# EAGLE design Uni-2.4 (EAGLE 9.6.2)

## Sheet 1 of 4
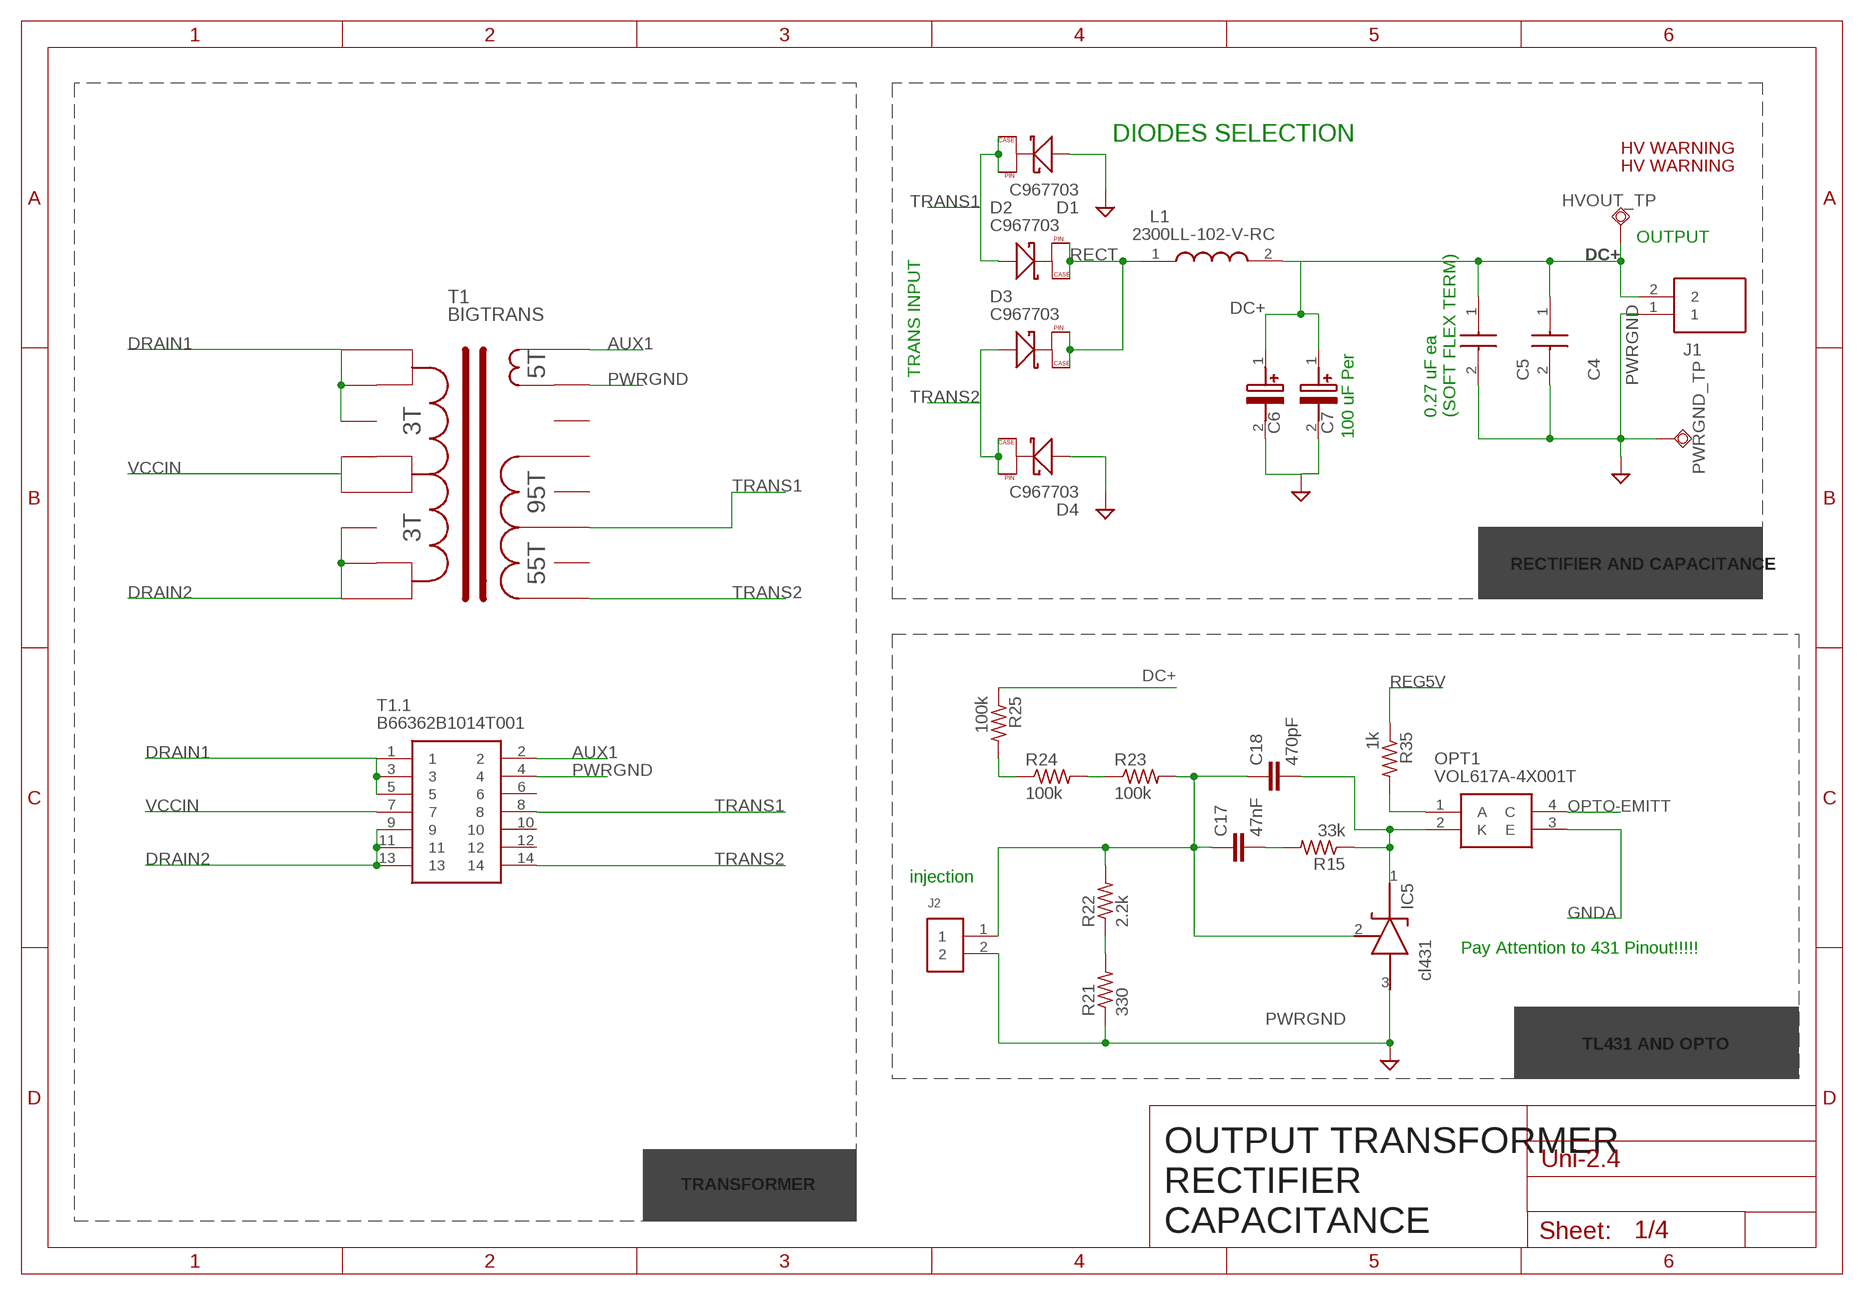
[diagram p0: schematic, sheet 1]

### Parts
C4  C1812C274KCRACAUTO  [C1812]
C5  C1812C274KCRACAUTO  [C1812]
C6  400BXW100MEFR18X25  [CAPPRD750W80D1825H2700]
C7  400BXW100MEFR18X25  [CAPPRD750W80D1825H2700]
C17  47nF  C-EUC0603K  [C0603K]
C18  470pF  C-EUC0603K  [C0603K]
D1  C967703  SICDIODE  [TO-252]
D2  C967703  SICDIODE  [TO-252]
D3  C967703  SICDIODE  [TO-252]
D4  C967703  SICDIODE  [TO-252]
HVOUT_TP  TPSQPAD1-13  [P1-13]
IC5  cl431  TL431CL3T  [SOT95P280X145-3N]
J1  TB005-762-02BE  [TB00576202BE]
J2  61300211121  [61300211121]
L1  2300LL-102-V-RC  [2300LL102VRC]
OPT1  VOL617A-4X001T  [SOP254P1015X230-4N]
PWRGND_TP  TPSQPAD1-13  [P1-13]
R15  33k  R-US_R0603  [R0603]
R21  330  R-US_R0805  [R0805]
R22  2.2k  R-US_R0805  [R0805]
R23  100k  R-US_R1206  [R1206]
R24  100k  R-US_R1206  [R1206]
R25  100k  R-US_R1206  [R1206]
R35  1k  R-US_R0603  [R0603]
T1  BIGTRANS  [BIGTRANS!]
T1.1  B66362B1014T001  [B66362B1014T001]
U$3  HV  [PSFBC_ELECTRIC_SHOCK]
U$4  HV  [PSFBC_ELECTRIC_SHOCK]

### Nets
AUX1: T1.1.2 T1.16 ; also sheet 3
DC+: C4.1 C5.1 C6.1(+) C7.1(+) HVOUT_TP.TP J1.2 L1.2 R25.1 ; also sheet 2
DRAIN1: T1.1.1 T1.1.3 T1.1.5 T1.6 T1.7 T1.8 ; also sheet 4
DRAIN2: T1.1 T1.1.9 T1.1.11 T1.1.13 T1.2 T1.3 ; also sheet 4
GNDA: OPT1.3(E) ; also sheet 3,4
N$1: R24.1 R25.2
N$3: C17.1 C18.1 IC5.2(REF) J2.1 R22.2 R23.2
N$15: R23.1 R24.2
N$16: R21.2 R22.1
N$18: C18.2 IC5.1(CATHODE) OPT1.2(K) R15.1
N$19: OPT1.1(A) R35.2
N$21: C17.2 R15.2
OPTO-EMITT: OPT1.4(C) ; also sheet 4
PWRGND: C4.2 C5.2 C6.2(-) C7.2(-) D1.2(A) D4.2(A) IC5.3(ANODE) J1.1 J2.2 PWRGND_TP.TP R21.1 T1.1.4 T1.15 ; supply symbol labelled GND ; also sheet 2,3
RECT: D2.1(K_1) D2.3(K_2) D3.1(K_1) D3.3(K_2) L1.1
REG5V: R35.1 ; also sheet 3
TRANS1: D1.1(K_1) D1.3(K_2) D2.2(A) T1.1.8 T1.11
TRANS2: D3.2(A) D4.1(K_1) D4.3(K_2) T1.1.14 T1.9
VCCIN: T1.1.7 T1.4 T1.5 ; also sheet 3,4
Unconnected: T1.1.6 T1.1.10 T1.1.12 T1.10 T1.12 T1.13 T1.14

### Notes on the sheet
- DIODES SELECTION
- OUTPUT
- TRANS INPUT
- 0.27 uF ea
  (SOFT FLEX TERM)
- 100 uF Per
- RECTIFIER AND CAPACITANCE
- injection
- Pay Attention to 431 Pinout!!!!!
- TL431 AND OPTO
- TRANSFORMER
- OUTPUT TRANSFORMER
  RECTIFIER
  CAPACITANCE

## Sheet 2 of 4
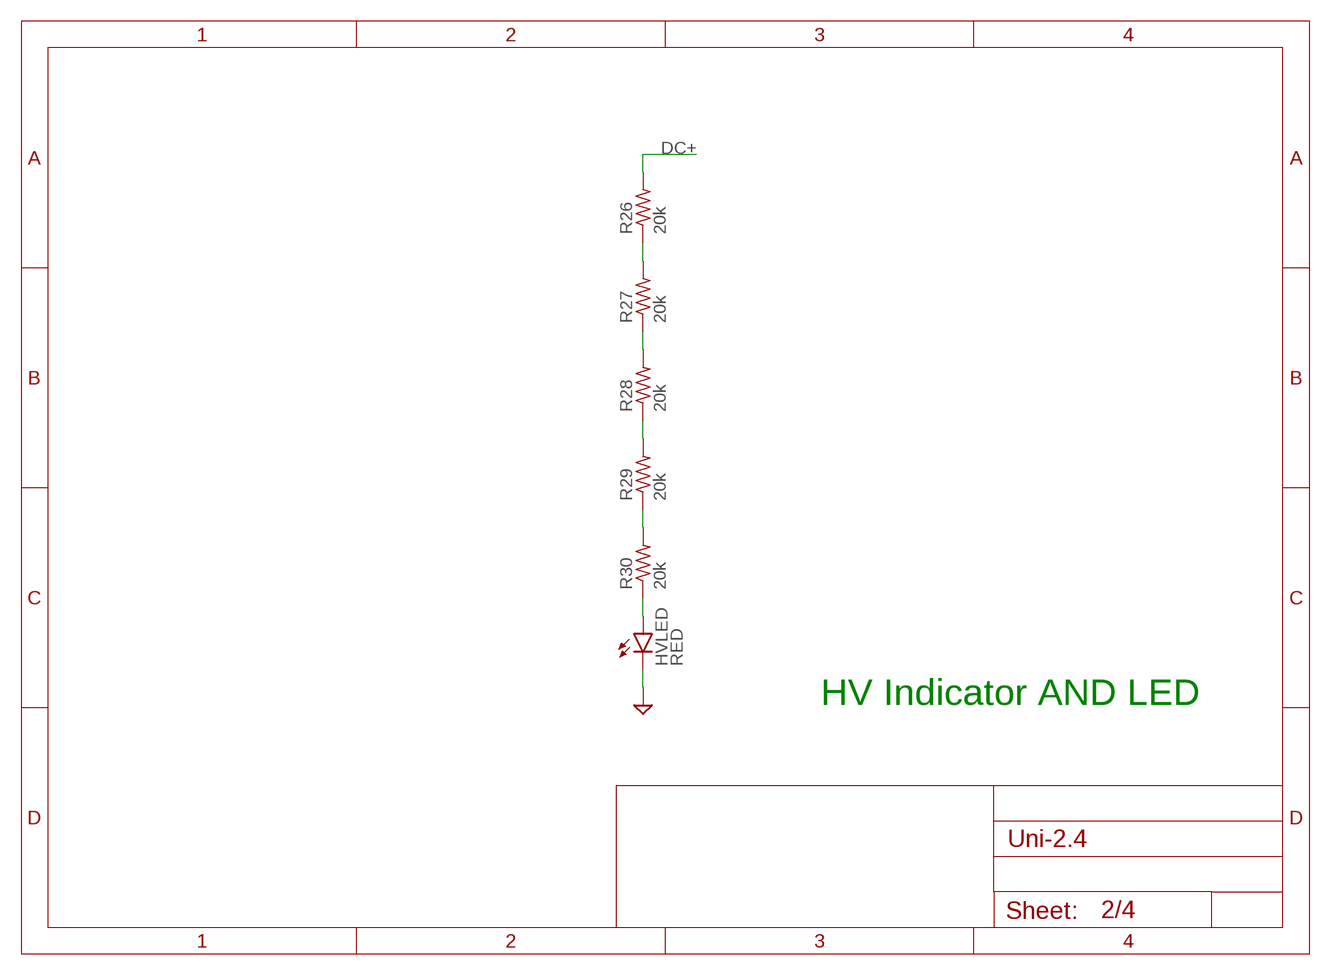
[diagram p1: schematic, sheet 2]

### Parts
HVLED  RED  LEDCHIPLED_0805  [CHIPLED_0805]
R26  20k  R-US_R1206  [R1206]
R27  20k  R-US_R1206  [R1206]
R28  20k  R-US_R1206  [R1206]
R29  20k  R-US_R1206  [R1206]
R30  20k  R-US_R1206  [R1206]

### Nets
DC+: R26.2 ; also sheet 1
N$12: HVLED.A R30.1
N$14: R29.1 R30.2
N$17: R28.1 R29.2
N$24: R27.1 R28.2
N$28: R26.1 R27.2
PWRGND: HVLED.C ; supply symbol labelled GND ; also sheet 1,3

### Notes on the sheet
- HV Indicator AND LED

## Sheet 3 of 4
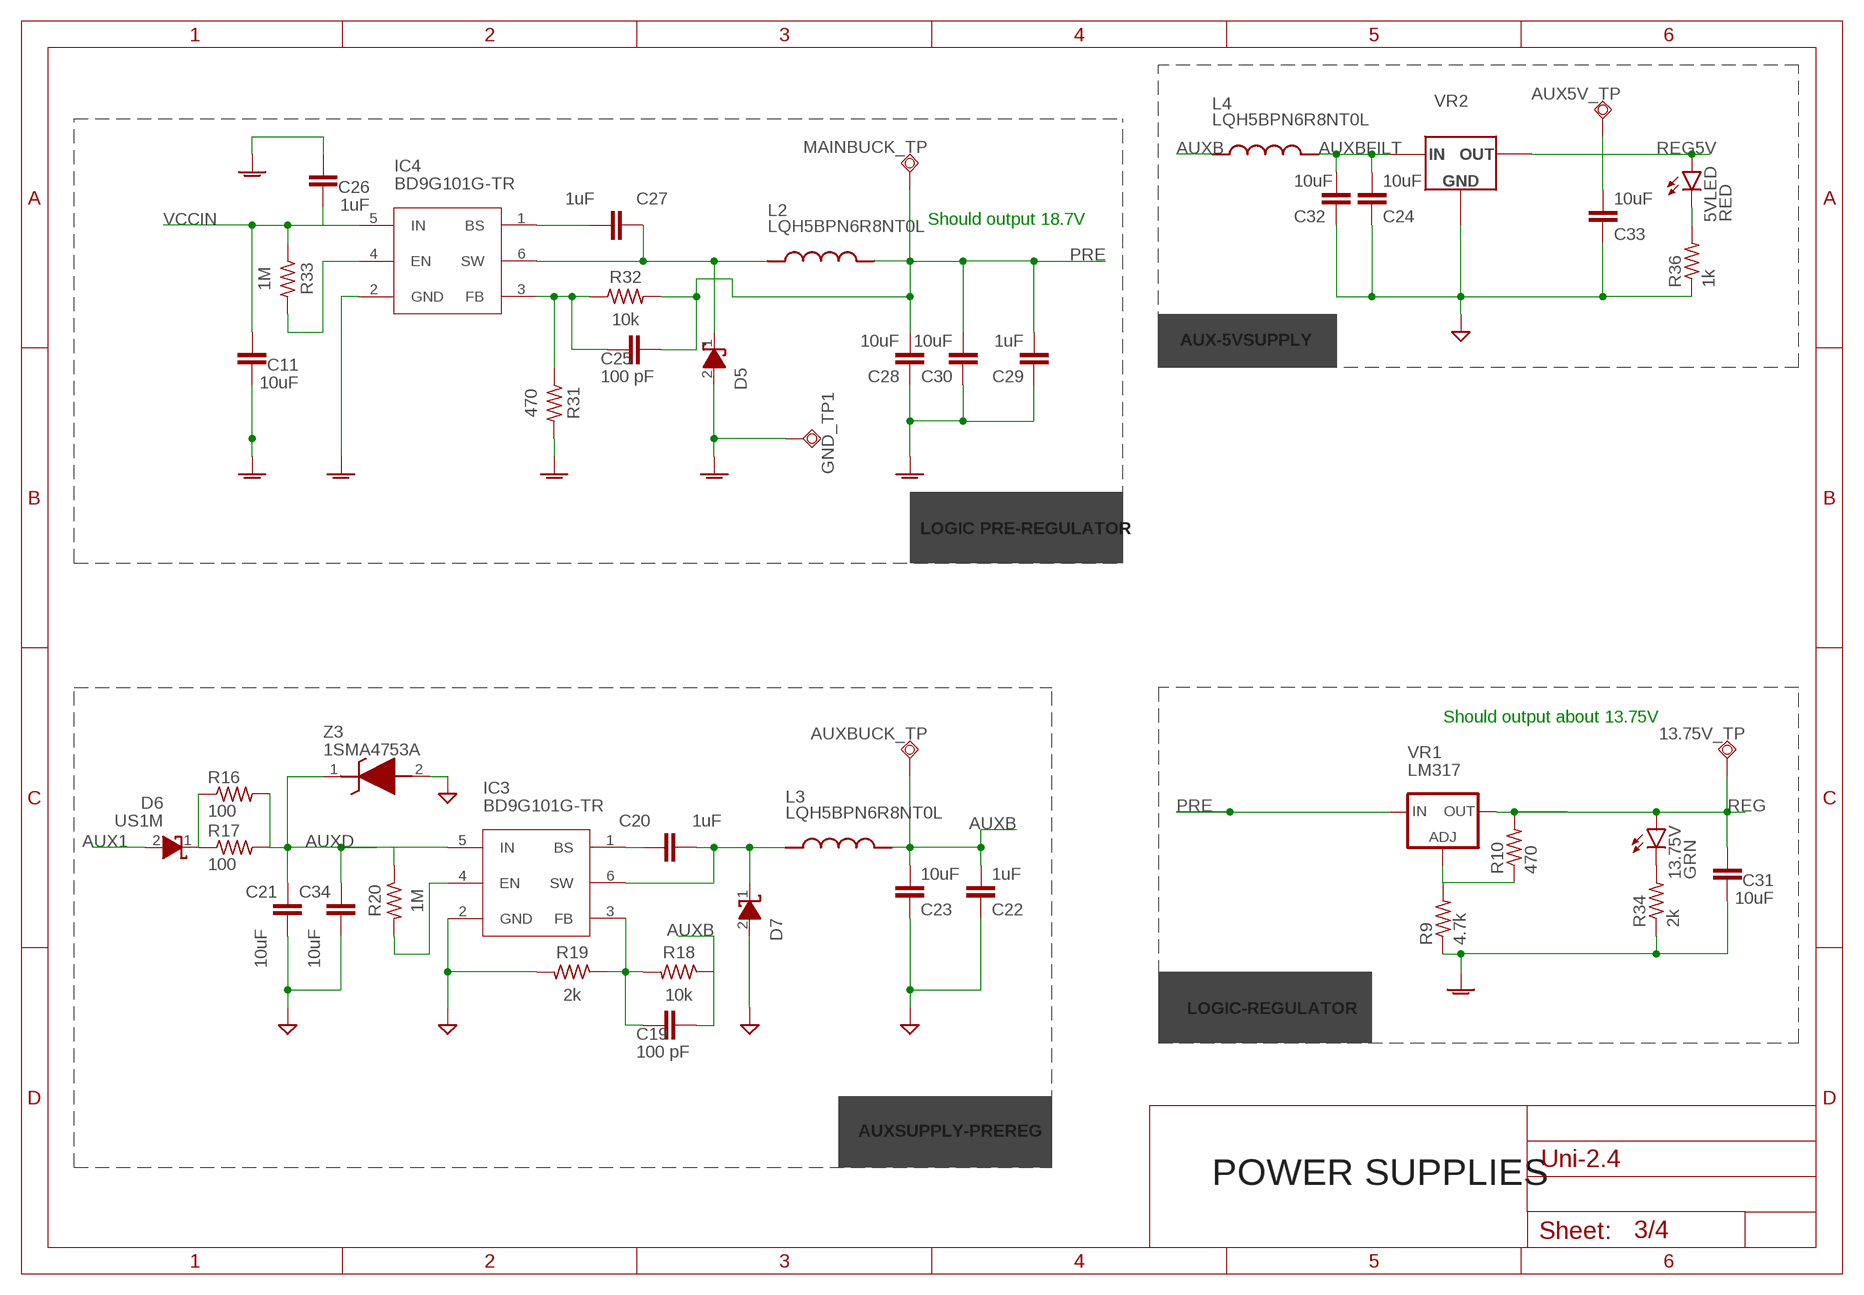
[diagram p2: schematic, sheet 3]

### Parts
5VLED  RED  LEDCHIPLED_0805  [CHIPLED_0805]
13.75V  GRN  LEDCHIPLED_0805  [CHIPLED_0805]
13.75V_TP  TPSQPAD1-17  [P1-17]
AUX5V_TP  TPSQPAD1-17  [P1-17]
AUXBUCK_TP  TPSQPAD1-17  [P1-17]
C11  10uF  C-EUC0805K  [C0805K]
C19  100 pF  C-EUC0402K  [C0402K]
C20  1uF  C-EUC0603K  [C0603K]
C21  10uF  C-EUC0805K  [C0805K]
C22  1uF  C-EUC0402  [C0402]
C23  10uF  C-EUC0603K  [C0603K]
C24  10uF  C-EUC0603K  [C0603K]
C25  100 pF  C-EUC0402K  [C0402K]
C26  1uF  C-EUC0603K  [C0603K]
C27  1uF  C-EUC0603K  [C0603K]
C28  10uF  C-EUC0603K  [C0603K]
C29  1uF  C-EUC0603K  [C0603K]
C30  10uF  C-EUC0603K  [C0603K]
C31  10uF  C-EUC0603K  [C0603K]
C32  10uF  C-EUC0603K  [C0603K]
C33  10uF  C-EUC0603K  [C0603K]
C34  10uF  C-EUC0805K  [C0805K]
D5  SCHOTTKY  [DIOM5127X229N]
D6  US1M  SCHOTTKY  [DIOM5127X229N]
D7  SCHOTTKY  [DIOM5127X229N]
GND_TP1  TPSQPAD1-13  [P1-13]
IC3  BD9G101G-TR  [SOT95P280X145-6N]
IC4  BD9G101G-TR  [SOT95P280X145-6N]
L2  LQH5BPN6R8NT0L  [LQH5BPB100MT0L]
L3  LQH5BPN6R8NT0L  [LQH5BPB100MT0L]
L4  LQH5BPN6R8NT0L  [LQH5BPB100MT0L]
MAINBUCK_TP  TPSQPAD1-17  [P1-17]
R9  4.7k  R-US_R0603  [R0603]
R10  470  R-US_R0603  [R0603]
R16  100  R-US_R1206  [R1206]
R17  100  R-US_R1206  [R1206]
R18  10k  R-US_R0402  [R0402]
R19  2k  R-US_R0402  [R0402]
R20  1M  R-US_R0402  [R0402]
R31  470  R-US_R0603  [R0603]
R32  10k  R-US_R0402  [R0402]
R33  1M  R-US_R0402  [R0402]
R34  2k  R-US_R0603  [R0603]
R36  1k  R-US_R0603  [R0603]
VR1  LM317  LM317MBDT  [DPACK]
VR2  AP2120N-5.0TRG1  [SOT95P280X145-3N]
Z3  1SMA4753A  1SMA5942BT3G  [DIOM5226X220N]

### Nets
AUX1: D6.2(A) ; also sheet 1
AUXB: AUXBUCK_TP.TP C19.1 C22.2 C23.2 L3.2 L4.1 R18.1
AUXBFILT: C24.2 C32.2 L4.2 VR2.3(VIN)
AUXD: C21.1 C34.1 IC3.5(IN) R16.2 R17.2 R20.1 Z3.1(K)
BS1: C27.2 IC4.1(BS)
BS2: C20.1 IC3.1(BS)
EN1: IC4.4(EN) R33.2
EN2: IC3.4(EN) R20.2
FB1: C25.2 IC4.3(FB) R31.1 R32.1
FB2: C19.2 IC3.3(FB) R18.2 R19.1
GNDA: C11.1 C26.2 C28.1 C29.1 C30.1 C31.1 D5.2(A) GND_TP1.TP IC4.2(GND) R9.1 R31.2 R34.1 ; also sheet 1,4
N$10: R9.2 R10.1 VR1.1(ADJ)
N$22: 13.75V.C R34.2
N$26: 5VLED.C R36.2
N$27: D6.1(K) R16.1 R17.1
PRE: C25.1 C28.2 C29.2 C30.2 L2.2 MAINBUCK_TP.TP R32.2 VR1.3(IN)
PWRGND: C21.2 C22.1 C23.1 C24.1 C32.1 C33.1 C34.2 D7.2(A) IC3.2(GND) R19.2 R36.1 VR2.1(GND) Z3.2(A) ; supply symbol labelled GND ; also sheet 1,2
REG: 13.75V.A 13.75V_TP.TP C31.2 R10.2 VR1.4(OUT) ; also sheet 4
REG5V: 5VLED.A AUX5V_TP.TP C33.2 VR2.2(VOUT) ; also sheet 1
SWITCH1: C27.1 D5.1(K) IC4.6(SW) L2.1
SWITCH2: C20.2 D7.1(K) IC3.6(SW) L3.1
VCCIN: C11.2 C26.1 IC4.5(IN) R33.1 ; also sheet 1,4

### Notes on the sheet
- Should output 18.7V
- AUX-5VSUPPLY
- LOGIC PRE-REGULATOR
- Should output about 13.75V
- LOGIC-REGULATOR
- AUXSUPPLY-PREREG
- POWER SUPPLIES

## Sheet 4 of 4
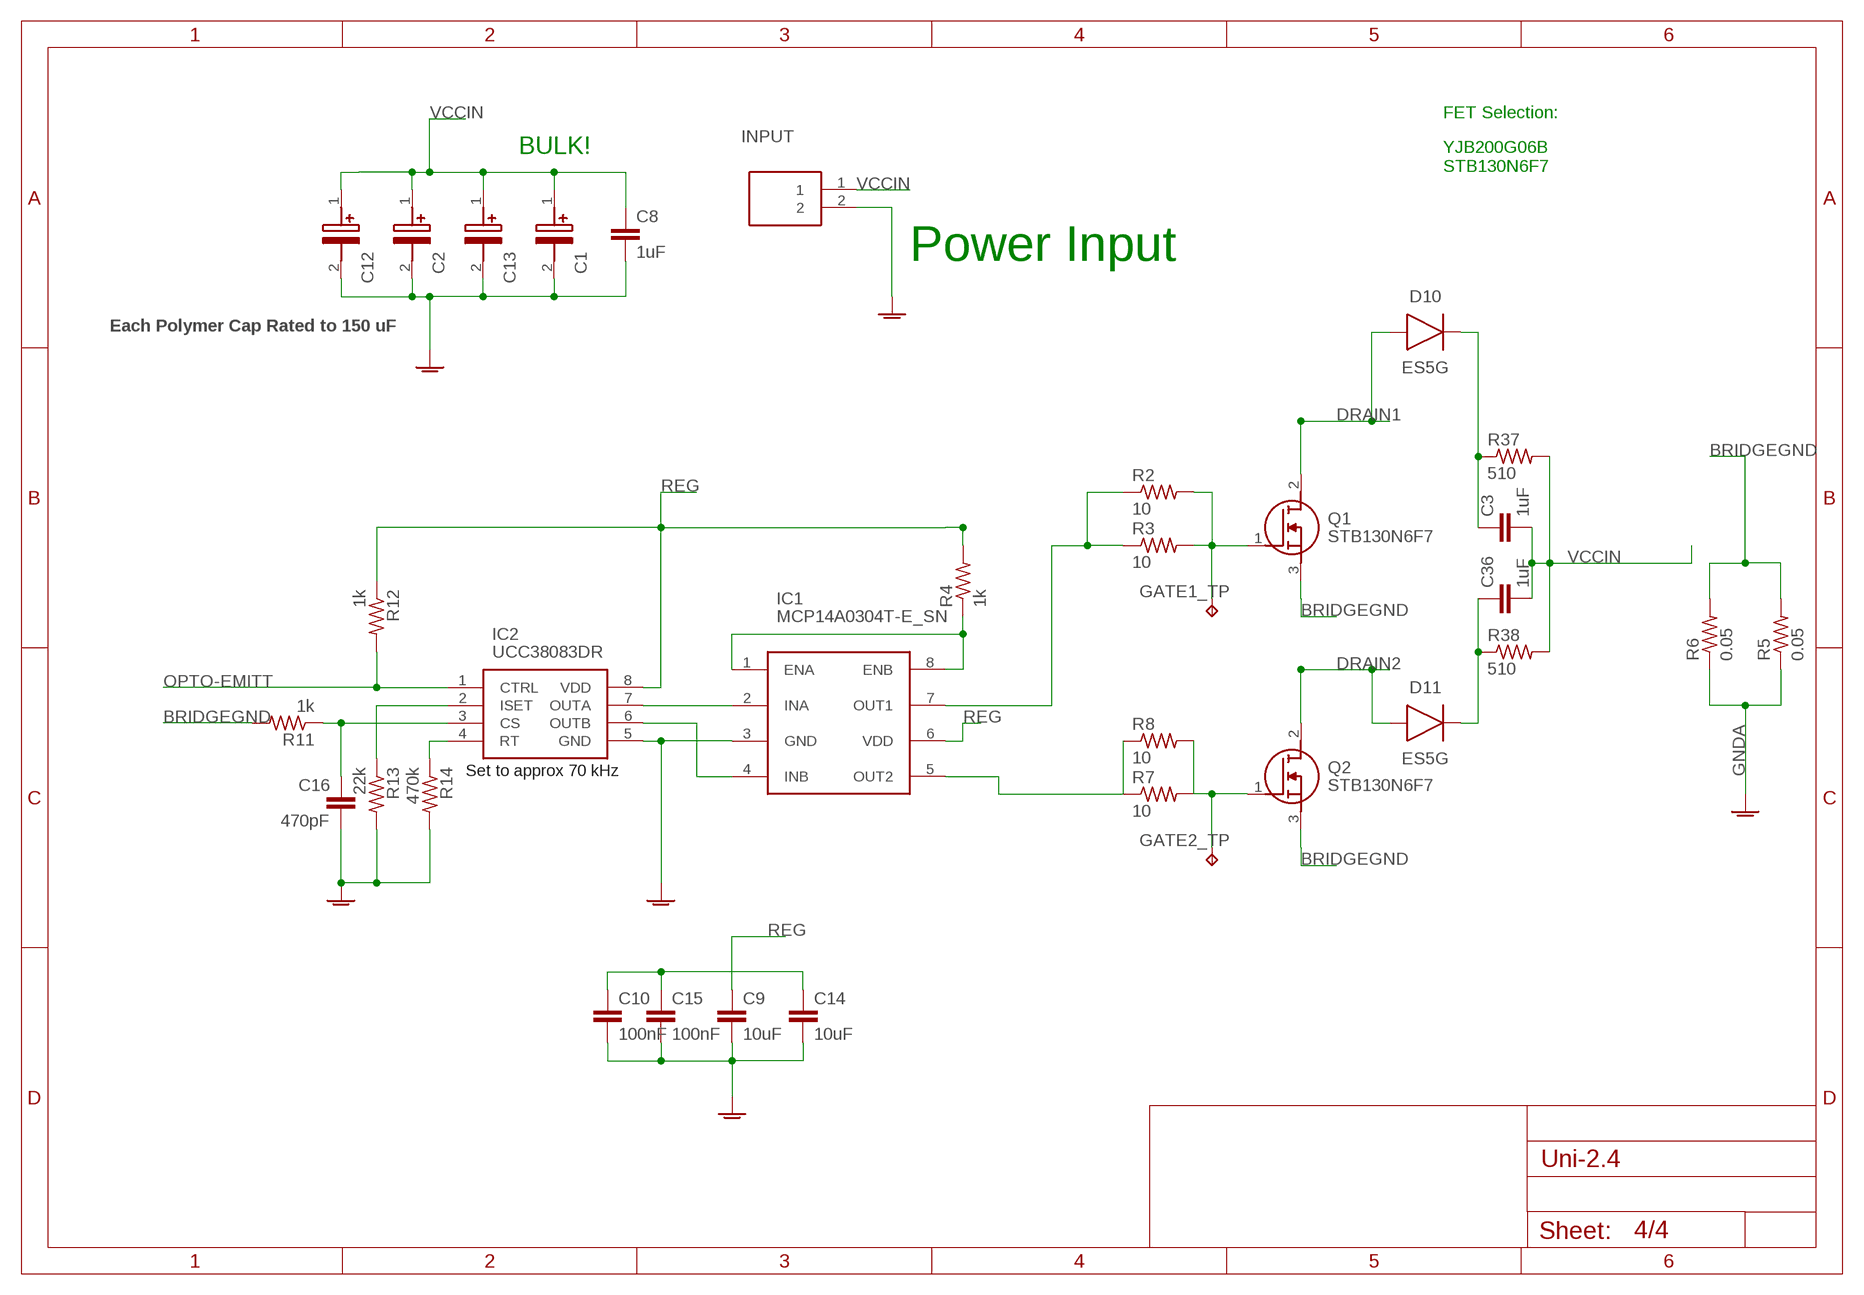
[diagram p3: schematic, sheet 4]

### Parts
C1  OVK151M1VTR-10131  [16SVF1000M]
C2  OVK151M1VTR-10131  [16SVF1000M]
C3  1uF  C-EUC1206K  [C1206K]
C8  1uF  C-EUC0805K  [C0805K]
C9  10uF  C-EUC0603K  [C0603K]
C10  100nF  C-EUC0402  [C0402]
C12  OVK151M1VTR-10131  [16SVF1000M]
C13  OVK151M1VTR-10131  [16SVF1000M]
C14  10uF  C-EUC0603K  [C0603K]
C15  100nF  C-EUC0402  [C0402]
C16  470pF  C-EUC0603K  [C0603K]
C36  1uF  C-EUC1206K  [C1206K]
D10  ES5G  DIODEDO-214AA(SMB)  [DIOM5336X265N]
D11  ES5G  DIODEDO-214AA(SMB)  [DIOM5336X265N]
GATE1_TP  TPTP13R  [TP13R]
GATE2_TP  TPTP13R  [TP13R]
IC1  MCP14A0304T-E_SN  [SOIC127P600X175-8N]
IC2  UCC38083DR  [SOIC127P600X175-8N]
INPUT  TB005-762-02BE  [TB00576202BE]
Q1  STB130N6F7  [D2PAK]
Q2  STB130N6F7  [D2PAK]
R2  10  R-US_R0805  [R0805]
R3  10  R-US_R0805  [R0805]
R4  1k  R-US_R0402  [R0402]
R5  0.05  R-US_R2512  [R2512]
R6  0.05  R-US_R2512  [R2512]
R7  10  R-US_R0805  [R0805]
R8  10  R-US_R0805  [R0805]
R11  1k  R-US_R0603  [R0603]
R12  1k  R-US_R0603  [R0603]
R13  22k  R-US_R0603  [R0603]
R14  470k  R-US_R0603  [R0603]
R37  510  R-US_R2512  [R2512]
R38  510  R-US_R2512  [R2512]

### Nets
BRIDGEGND: Q1.3(S) Q2.3(S) R5.2 R6.2 R11.2
CS-IN: C16.1 IC2.3(CS) R11.1
DRAIN1: D10.2(A) Q1.2(D) ; also sheet 1
DRAIN2: D11.2(A) Q2.2(D) ; also sheet 1
GNDA: C1.2(-) C2.2(-) C8.2 C9.2 C10.2 C12.2(-) C13.2(-) C14.2 C15.2 C16.2 IC1.3(GND) IC2.5(GND) INPUT.2 R5.1 R6.1 R13.2 R14.2 ; also sheet 1,3
N$2: IC1.2(INA) IC2.7(OUTA)
N$5: IC1.4(INB) IC2.6(OUTB)
N$6: IC1.1(ENA) IC1.8(ENB) R4.1
N$7: IC1.7(OUT1) R2.1 R3.1
N$8: IC1.5(OUT2) R7.1 R8.1
N$13: IC2.2(ISET) R13.1
N$20: C3.1 D10.1(C) R37.1
N$23: C36.1 D11.1(C) R38.1
OPTO-EMITT: IC2.1(CTRL) R12.2 ; also sheet 1
Q1G: GATE1_TP.TP Q1.1(G) R2.2 R3.2
Q2G: GATE2_TP.TP Q2.1(G) R7.2 R8.2
REG: C9.1 C10.1 C14.1 C15.1 IC1.6(VDD) IC2.8(VDD) R4.2 R12.1 ; also sheet 3
RT: IC2.4(RT) R14.1
VCCIN: C1.1(+) C2.1(+) C3.2 C8.1 C12.1(+) C13.1(+) C36.2 INPUT.1 R37.2 R38.2 ; also sheet 1,3

### Notes on the sheet
- FET Selection:
- BULK!
- YJB200G06B
  STB130N6F7
- Power Input
- Each Polymer Cap Rated to 150 uF
- Set to approx 70 kHz

## Library data of the parts
5VLED 13.75V = led:LED: LED OSRAM: - CHIPLED LG R971, LG N971, LY N971, LG Q971, LY Q971, LO R971, LY R971 LH N974, LH R974 LS Q976, LO Q976, LY Q976 LO Q996 - Hyper CHIPLED LW Q18S LB Q993, LB Q99A, LB R99A - SideLED LS A670, LO A670, LY A670, LG A670, LP A670 LB A673, LV A673, LT A673, LW A673 LH A674 LY A675 LS A676, LA A676, LO A676, LY A676, LW A676 LS A679, LY A679, LG A679 - Hyper Micro SIDELED® LS Y876, LA Y876, LO Y876, LY Y876 LT Y87S - SmartLED LW L88C, LW L88S LB L89C, LB L89S, LG L890 LS L89K, LO L89K, LY L89K LS L896, LA L896, LO L896, LY L896 - TOPLED LS T670, LO T670, LY T670, LG T670, LP T670 LSG T670, LSP T670, LSY T670, LOP T670, LYG T670 LG T671, LOG T671, LSG T671 LB T673, LV T673, LT T673, LW T673 LH T674 LS T676, LA T676, LO T676, LY T676, LB T676, LH T676, LSB T676, LW T676 LB T67C, LV T67C, LT T67C, LS T67K, LO T67K, LY T67K, LW E67C LS E67B, LA E67B, LO E67B, LY E67B, LB E67C, LV E67C, LT E67C LW T67C LS T679, LY T679, LG T679 LS T770, LO T770, LY T770, LG T770, LP T770 LB T773, LV T773, LT T773, LW T773 LH T774 LS E675, LA E675, LY E675, LS T675 LS T776, LA T776, LO T776, LY T776, LB T776 LHGB T686 LT T68C, LB T68C - Hyper Mini TOPLED® LB M676 - Mini TOPLED Santana® LG M470 LS M47K, LO M47K, LY M47K Source: http://www.osram.convergy.de LUXEON: - LUMILED® LXK2-PW12-R00, LXK2-PW12-S00, LXK2-PW14-U00, LXK2-PW14-V00 LXK2-PM12-R00, LXK2-PM12-S00, LXK2-PM14-U00 LXK2-PE12-Q00, LXK2-PE12-R00, LXK2-PE12-S00, LXK2-PE14-T00, LXK2-PE14-U00 LXK2-PB12-K00, LXK2-PB12-L00, LXK2-PB12-M00, LXK2-PB14-N00, LXK2-PB14-P00, LXK2-PB14-Q00 LXK2-PR12-L00, LXK2-PR12-M00, LXK2-PR14-Q00, LXK2-PR14-R00 LXK2-PD12-Q00, LXK2-PD12-R00, LXK2-PD12-S00 LXK2-PH12-R00, LXK2-PH12-S00 LXK2-PL12-P00, LXK2-PL12-Q00, LXK2-PL12-R00 Source: www.luxeon.com KINGBRIGHT: KA-3528ASYC Source: www.kingbright.com; LCSC_PART: C72043
13.75V_TP AUX5V_TP AUXBUCK_TP GND_TP1 HVOUT_TP MAINBUCK_TP PWRGND_TP = testpad:TPSQ: Test pad
C1 C2 C12 C13 = SamacSys_Parts:OVK151M1VTR-1013: OVK151M1VTR-1013
C3 C17 C18 C21 C33 C34 C36 = rcl:C-EU: CAPACITOR, European symbol; SPICEPREFIX: C
C4 C5 = SamacSys_Parts:C1812C274KCRACAUTO: SMD Auto X7R HV, Ceramic, 0.27 uF, 10%, 500 VDC, 750 VDC, 125?C, -55?C, X7R, SMD, MLCC, High Voltage, Temperature Stable, Automotive Grade, 2.5 % , 370.4 MOhms, 185 mg, 1812, 4.5mm, 3.2mm, 1.9mm, 0.6mm, 500, 78 Weeks, 80 Source: Datasheet <https://componentsearchengine.com/Datasheets/1/C1812C274KCRACAUTO.pdf>; DESCRIPTION: SMD Auto X7R HV, Ceramic, 0.27 uF, 10%, 500 VDC, 750 VDC, 125?C, -55?C, X7R, SMD, MLCC, High Voltage, Temperature Stable, Automotive Grade, 2.5 % , 370.4 MOhms, 185 mg, 1812, 4.5mm, 3.2mm, 1.9mm, 0.6mm, 500, 78 Weeks, 80; HEIGHT: 1.55mm; MANUFACTURER_NAME: KEMET; MANUFACTURER_PART_NUMBER: C1812C274KCRACAUTO; MOUSER_PART_NUMBER: 80-C1812C274KCRAUTO; MOUSER_PRICE-STOCK: https://www.mouser.com/Search/Refine.aspx?Keyword=80-C1812C274KCRAUTO
C6 C7 = SamacSys_Parts:400BXW100MEFR18X25: Aluminum Electrolytic Capacitors - Radial Leaded LONG LIFE ELECTROLYTIC CAPACITORS Source: Datasheet <http://www.rubycon.co.jp/en/catalog/e_pdfs/aluminum/e_BXW.pdf>; DESCRIPTION: Aluminum Electrolytic Capacitors - Radial Leaded LONG LIFE ELECTROLYTIC CAPACITORS; HEIGHT: 27mm; MANUFACTURER_NAME: Rubycon; MANUFACTURER_PART_NUMBER: 400BXW100MEFR18X25
C8-C10 C14 C15 C22-C24 C26 C32 = rcl:C-EU: CAPACITOR, European symbol; LCSC_PART: C440198; SPICEPREFIX: C
C11 C28-C31 = rcl:C-EU: CAPACITOR, European symbol; LCSC_PART: C440198
C16 = rcl:C-EU: CAPACITOR, European symbol; LCSC_PART: C1620; SPICEPREFIX: C
C19 C25 = rcl:C-EU: CAPACITOR, European symbol; LCSC_PART: C1546; SPICEPREFIX: C
C20 C27 = rcl:C-EU: CAPACITOR, European symbol; LCSC_PART: C14663; SPICEPREFIX: C
D1-D4 = SamacSys_Parts:SICDIODE: SiC TO-252 Diode
D5 D7 = SamacSys_Parts:SCHOTTKY: Schottky Diodes & Rectifiers 60V Sctky Bar Rectfr SMA (DO-214AC) Source: Datasheet <https://www.arrow.com/en/products/ss16he3-bh/vishay>; DESCRIPTION: Schottky Diodes & Rectifiers 60V Sctky Bar Rectfr SMA (DO-214AC); HEIGHT: 2.29mm; LCSC_PART: C22452; MANUFACTURER_NAME: Vishay; MANUFACTURER_PART_NUMBER: SS16HE3_B/H; MOUSER_PART_NUMBER: 78-SS16HE3_B/H; MOUSER_PRICE-STOCK: https://www.mouser.co.uk/ProductDetail/Vishay-General-Semiconductor/SS16HE3_B-H?qs=MLItCLRbWsyJmaJ87KUvIw%3D%3D
D6 = SamacSys_Parts:SCHOTTKY: Schottky Diodes & Rectifiers 60V Sctky Bar Rectfr SMA (DO-214AC) Source: Datasheet <https://www.arrow.com/en/products/ss16he3-bh/vishay>; DESCRIPTION: Schottky Diodes & Rectifiers 60V Sctky Bar Rectfr SMA (DO-214AC); HEIGHT: 2.29mm; MANUFACTURER_NAME: Vishay; MANUFACTURER_PART_NUMBER: SS16HE3_B/H; MOUSER_PART_NUMBER: 78-SS16HE3_B/H; MOUSER_PRICE-STOCK: https://www.mouser.co.uk/ProductDetail/Vishay-General-Semiconductor/SS16HE3_B-H?qs=MLItCLRbWsyJmaJ87KUvIw%3D%3D
D10 = Diode:DIODE: Diode Rectifier - Generic; CATEGORY: Diode; LCSC_PART: C128705; SUB-CATEGORY: Rectifier; VALUE: DIODE
D11 = Diode:DIODE: Diode Rectifier - Generic; CATEGORY: Diode; SUB-CATEGORY: Rectifier; VALUE: DIODE
GATE1_TP GATE2_TP = testpad:TP: Test pad
HVLED = led:LED: LED OSRAM: - CHIPLED LG R971, LG N971, LY N971, LG Q971, LY Q971, LO R971, LY R971 LH N974, LH R974 LS Q976, LO Q976, LY Q976 LO Q996 - Hyper CHIPLED LW Q18S LB Q993, LB Q99A, LB R99A - SideLED LS A670, LO A670, LY A670, LG A670, LP A670 LB A673, LV A673, LT A673, LW A673 LH A674 LY A675 LS A676, LA A676, LO A676, LY A676, LW A676 LS A679, LY A679, LG A679 - Hyper Micro SIDELED® LS Y876, LA Y876, LO Y876, LY Y876 LT Y87S - SmartLED LW L88C, LW L88S LB L89C, LB L89S, LG L890 LS L89K, LO L89K, LY L89K LS L896, LA L896, LO L896, LY L896 - TOPLED LS T670, LO T670, LY T670, LG T670, LP T670 LSG T670, LSP T670, LSY T670, LOP T670, LYG T670 LG T671, LOG T671, LSG T671 LB T673, LV T673, LT T673, LW T673 LH T674 LS T676, LA T676, LO T676, LY T676, LB T676, LH T676, LSB T676, LW T676 LB T67C, LV T67C, LT T67C, LS T67K, LO T67K, LY T67K, LW E67C LS E67B, LA E67B, LO E67B, LY E67B, LB E67C, LV E67C, LT E67C LW T67C LS T679, LY T679, LG T679 LS T770, LO T770, LY T770, LG T770, LP T770 LB T773, LV T773, LT T773, LW T773 LH T774 LS E675, LA E675, LY E675, LS T675 LS T776, LA T776, LO T776, LY T776, LB T776 LHGB T686 LT T68C, LB T68C - Hyper Mini TOPLED® LB M676 - Mini TOPLED Santana® LG M470 LS M47K, LO M47K, LY M47K Source: http://www.osram.convergy.de LUXEON: - LUMILED® LXK2-PW12-R00, LXK2-PW12-S00, LXK2-PW14-U00, LXK2-PW14-V00 LXK2-PM12-R00, LXK2-PM12-S00, LXK2-PM14-U00 LXK2-PE12-Q00, LXK2-PE12-R00, LXK2-PE12-S00, LXK2-PE14-T00, LXK2-PE14-U00 LXK2-PB12-K00, LXK2-PB12-L00, LXK2-PB12-M00, LXK2-PB14-N00, LXK2-PB14-P00, LXK2-PB14-Q00 LXK2-PR12-L00, LXK2-PR12-M00, LXK2-PR14-Q00, LXK2-PR14-R00 LXK2-PD12-Q00, LXK2-PD12-R00, LXK2-PD12-S00 LXK2-PH12-R00, LXK2-PH12-S00 LXK2-PL12-P00, LXK2-PL12-Q00, LXK2-PL12-R00 Source: www.luxeon.com KINGBRIGHT: KA-3528ASYC Source: www.kingbright.com
IC1 = SamacSys_Parts:MCP14A0304T-E_SN: Microchip Technology MCP14A0304T-E/SN Dual Low Side MOSFET Power Driver, 3A 8-Pin, SOIC Source: Datasheet <http://www.microchip.com/mymicrochip/filehandler.aspx?ddocname=en606629>; DESCRIPTION: Microchip Technology MCP14A0304T-E/SN Dual Low Side MOSFET Power Driver, 3A 8-Pin, SOIC; HEIGHT: 1.75mm; MANUFACTURER_NAME: Microchip; MANUFACTURER_PART_NUMBER: MCP14A0304T-E/SN; MOUSER_PART_NUMBER: 579-MCP14A0304T-E/SN; MOUSER_PRICE-STOCK: https://www.mouser.co.uk/ProductDetail/Microchip-Technology/MCP14A0304T-E-SN?qs=w%2Fv1CP2dgqqqWUCaoFqV0w%3D%3D
IC2 = SamacSys_Parts:UCC38083DR: Current Mode Push-Pull PWM With Programmable Slope Compensation Source: Datasheet <http://www.ti.com/lit/gpn/ucc38083>; DESCRIPTION: Current Mode Push-Pull PWM With Programmable Slope Compensation; HEIGHT: 1.75mm; MANUFACTURER_NAME: Texas Instruments; MANUFACTURER_PART_NUMBER: UCC38083DR; MOUSER_PART_NUMBER: 595-UCC38083DR; MOUSER_PRICE-STOCK: https://www.mouser.co.uk/ProductDetail/Texas-Instruments/UCC38083DR/?qs=zqbRmZ%252BfZD9Rvt3ie7yhvg%3D%3D
IC3 IC4 = SamacSys_Parts:BD9G101G-TR; LCSC_PART: C97643
IC5 = SamacSys_Parts:TL431CL3T: Adjustable micropower shunt voltage reference Source: Datasheet <https://www.st.com/resource/en/datasheet/tl431.pdf>; DESCRIPTION: Adjustable micropower shunt voltage reference; HEIGHT: 1.12mm; MANUFACTURER_NAME: STMicroelectronics; MANUFACTURER_PART_NUMBER: TL431CL3T; MOUSER_PART_NUMBER: 511-TL431CL3T; MOUSER_PRICE-STOCK: https://www.mouser.co.uk/ProductDetail/STMicroelectronics/TL431CL3T?qs=L6eUzyzWLAsU2SYO1NdhdA%3D%3D
INPUT J1 = SamacSys_Parts:TB005-762-02BE: Fixed Terminal Blocks screw type, 7.62 , horizontal, 2 poles, CUI Blue, slotted screw, PCB mount Source: Datasheet <https://componentsearchengine.com/Datasheets/1/TB005-762-02BE.pdf>; DESCRIPTION: Fixed Terminal Blocks screw type, 7.62 , horizontal, 2 poles, CUI Blue, slotted screw, PCB mount; HEIGHT: 21.7mm; MANUFACTURER_NAME: CUI Inc.; MANUFACTURER_PART_NUMBER: TB005-762-02BE; MOUSER_PART_NUMBER: 490-TB005-762-02BE; MOUSER_PRICE-STOCK: https://www.mouser.co.uk/ProductDetail/CUI-Devices/TB005-762-02BE?qs=vLWxofP3U2zXv1H2wuShow%3D%3D
J2 = Headers:61300211121: CONN HEADER VERT 2POS 2.54MM Manufacturer's datasheet <https://katalog.we-online.de/em/datasheet/6130xx11121.pdf>; CREATED_BY: PCBLayout.com; DIGI_KEY_PART_NUMBER: 732-5315-ND; MANUFACTURER: Wurth Electronics Inc.; MPN: 61300211121
L1 = SamacSys_Parts:2300LL-102-V-RC: Inductor High Current Toroid 1000uH/378.9uH 15% 1KHz 3.5A 137mOhm DCR RDL Source: Datasheet; DESCRIPTION: Inductor High Current Toroid 1000uH/378.9uH 15% 1KHz 3.5A 137mOhm DCR RDL; HEIGHT: 32.512mm; MANUFACTURER_NAME: Bourns; MANUFACTURER_PART_NUMBER: 2300LL-102-V-RC; MOUSER_PART_NUMBER: 652-2300LL-102-V-RC; MOUSER_PRICE-STOCK: https://www.mouser.co.uk/ProductDetail/Bourns/2300LL-102-V-RC?qs=d7g9p1yFhWZHzfawXthNnQ%3D%3D
L2-L4 = SamacSys_Parts:LQH5BPN6R8NT0L: MURATA - LQH5BPN6R8NT0L - INDUCTOR, 6.8UH, +/-30%, POWER Source: Datasheet <https://psearch.en.murata.com/inductor/product/LQH5BPN6R8NT0#.html>; DESCRIPTION: MURATA - LQH5BPN6R8NT0L - INDUCTOR, 6.8UH, +/-30%, POWER; HEIGHT: 2.2mm; MANUFACTURER_NAME: Murata Electronics; MANUFACTURER_PART_NUMBER: LQH5BPN6R8NT0L; MOUSER_PART_NUMBER: 81-LQH5BPN6R8NT0L0L; MOUSER_PRICE-STOCK: https://www.mouser.co.uk/ProductDetail/Murata-Electronics/LQH5BPN6R8NT0L?qs=3ZwS9AhGA%2F4N8axqd87eRQ%3D%3D
OPT1 = SamacSys_Parts:VOL617A-4X001T: Vishay VOL617A-4X001T DC Input Phototransistor Output Optocoupler, Surface Mount, 4-Pin LSOP Source: Datasheet <https://www.vishay.com/docs/82424/vol617a.pdf>; DESCRIPTION: Vishay VOL617A-4X001T DC Input Phototransistor Output Optocoupler, Surface Mount, 4-Pin LSOP; HEIGHT: 2.3mm; MANUFACTURER_NAME: Vishay; MANUFACTURER_PART_NUMBER: VOL617A-4X001T; MOUSER_PART_NUMBER: 78-VOL617A-4X001T; MOUSER_PRICE-STOCK: https://www.mouser.co.uk/ProductDetail/Vishay-Semiconductors/VOL617A-4X001T?qs=s4XK1XdnRilEoTFGQUoymA%3D%3D
Q1 Q2 = SamacSys_Parts:STB130N6F7
R2-R8 R15-R17 R21-R30 R35 R37 R38 = rcl:R-US_: RESISTOR, American symbol; SPICEPREFIX: R
R9 R10 R12 R34 R36 = rcl:R-US_: RESISTOR, American symbol; LCSC_PART: C22975; SPICEPREFIX: R
R11 = rcl:R-US_: RESISTOR, American symbol; LCSC_PART: C21190; SPICEPREFIX: R
R13 = rcl:R-US_: RESISTOR, American symbol; LCSC_PART: C31850; SPICEPREFIX: R
R14 = rcl:R-US_: RESISTOR, American symbol; LCSC_PART: C25811; SPICEPREFIX: R
R18 R19 R32 = rcl:R-US_: RESISTOR, American symbol; LCSC_PART: C25779; SPICEPREFIX: R
R20 R33 = rcl:R-US_: RESISTOR, American symbol; LCSC_PART: C25741; SPICEPREFIX: R
R31 = rcl:R-US_: RESISTOR, American symbol; LCSC_PART: C4177; SPICEPREFIX: R
T1 = SamacSys_Parts:BIGTRANS
T1.1 = SamacSys_Parts:B66362B1014T001: Ferrite Accessories, E Cores Accessories(EFD/ER/ETD), Coil former (ETD 34/17/11) Source: Datasheet <https://product.tdk.com/system/files/dam/doc/product/ferrite/ferrite/ferrite-acc/data_sheet/80/db/fer/etd_34_17_11.pdf>; DESCRIPTION: Ferrite Accessories, E Cores Accessories(EFD/ER/ETD), Coil former (ETD 34/17/11); HEIGHT: 33.1mm; MANUFACTURER_NAME: TDK; MANUFACTURER_PART_NUMBER: B66362B1014T001; MOUSER_PART_NUMBER: 871-B66362B1014T001; MOUSER_PRICE-STOCK: https://www.mouser.co.uk/ProductDetail/EPCOS-TDK/B66362B1014T001?qs=w5o0Loj0u7M9FVK%2Ff7P38g%3D%3D
U$3 U$4 = RMP - HALF BRIDGE 0.0.1:HV
VR1 = v-reg:LM317?*: 500 mA Adjustable Output Positive Voltage Regulator Source: http://www.onsemi.co.jp .. LM317M-D.PDF
VR2 = SamacSys_Parts:AP2120N-5.0TRG1: IC REG LINEAR 5V 150MA SOT23 Source: Datasheet; DESCRIPTION: IC REG LINEAR 5V 150MA SOT23; HEIGHT: 1.2mm; MANUFACTURER_NAME: Diodes Inc.; MANUFACTURER_PART_NUMBER: AP2120N-5.0TRG1; MOUSER_PART_NUMBER: 621-AP2120N-5.0TRG1; MOUSER_PRICE-STOCK: https://www.mouser.co.uk/ProductDetail/Diodes-Incorporated/AP2120N-50TRG1?qs=M%2FOdCRO8QQ3JQu49DdtyIA%3D%3D
Z3 = SamacSys_Parts:1SMA5942BT3G: ON Semiconductor 1SMA5942BT3G Zener Diode, 51V 5% 1.5 W SMT 2-Pin SMA Source: Datasheet <http://www.onsemi.com/pub/Collateral/1SMA5913BT3-D.PDF>; DESCRIPTION: ON Semiconductor 1SMA5942BT3G Zener Diode, 51V 5% 1.5 W SMT 2-Pin SMA; HEIGHT: 2.2mm; LCSC_PART: C362284; MANUFACTURER_NAME: onsemi; MANUFACTURER_PART_NUMBER: 1SMA5942BT3G; MOUSER_PART_NUMBER: 863-1SMA5942BT3G; MOUSER_PRICE-STOCK: https://www.mouser.co.uk/ProductDetail/ON-Semiconductor/1SMA5942BT3G?qs=y2kkmE52mdPrQGqg%252Bfz9yg%3D%3D

## Board
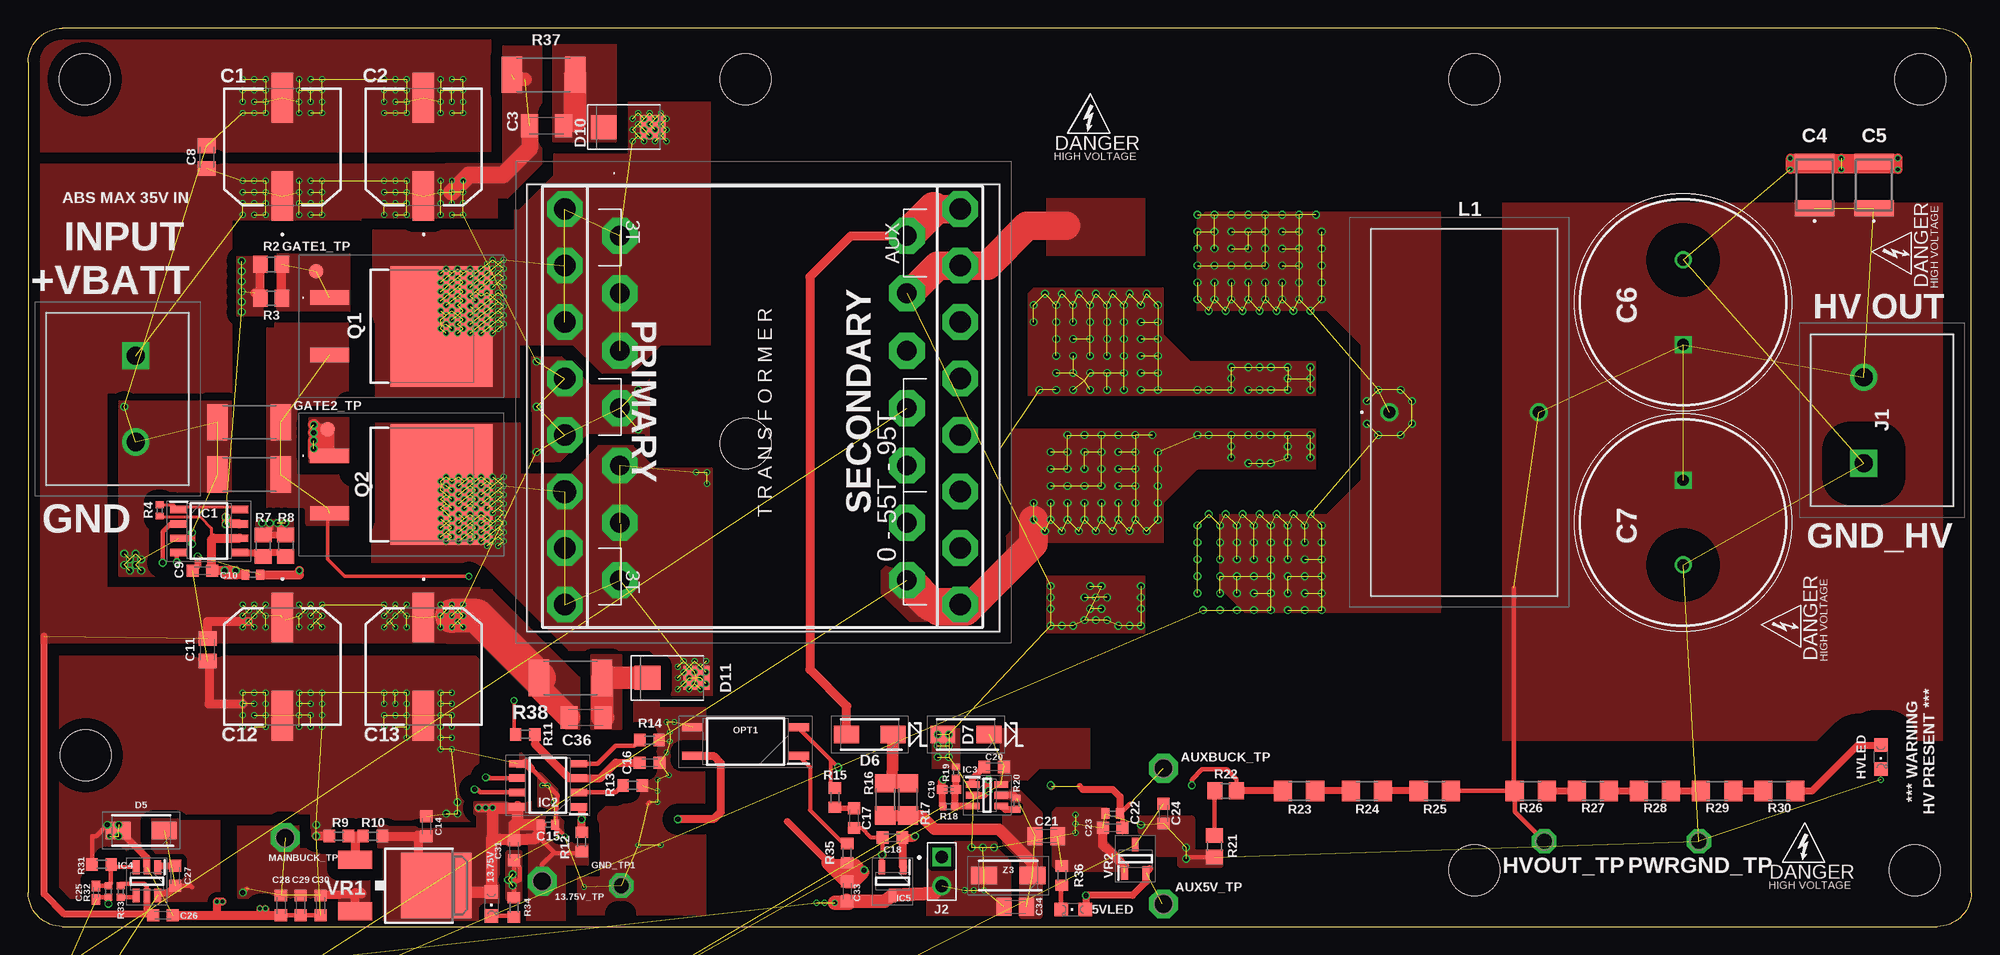
[diagram p4: board, top side]
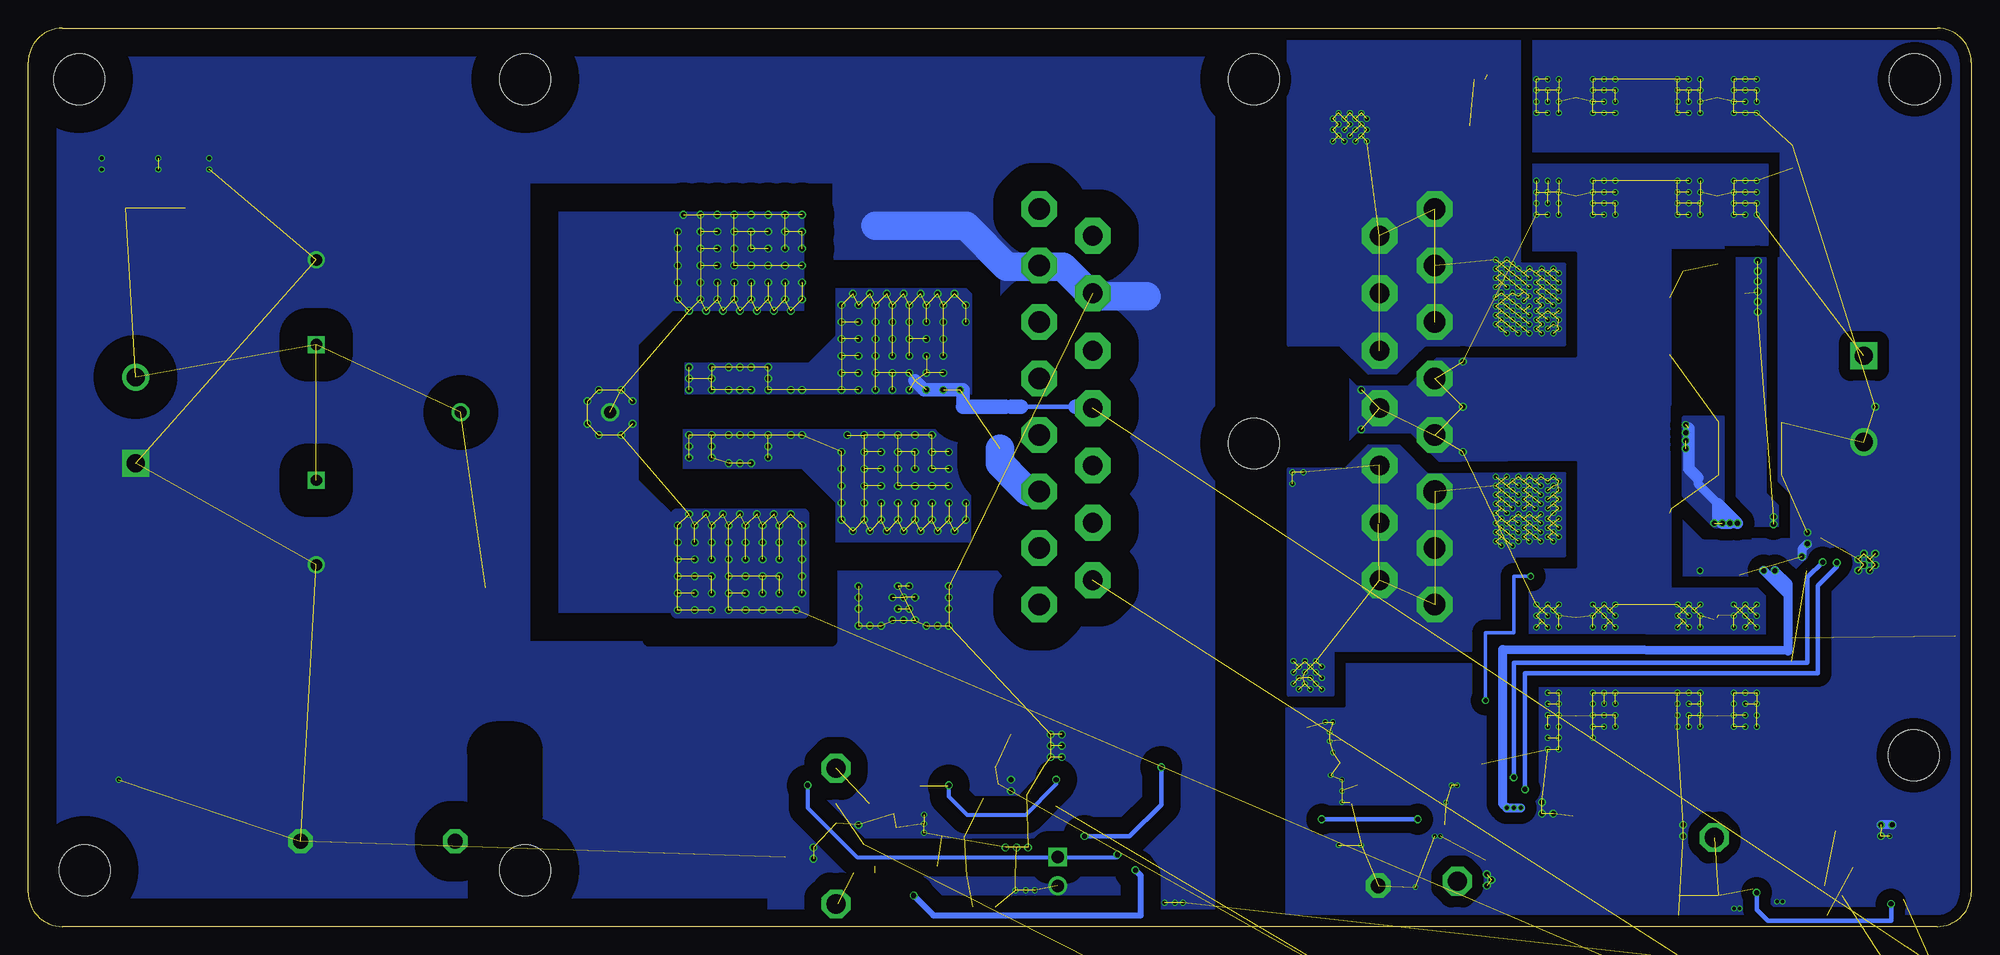
[diagram p5: board, bottom side, seen from below]

Size 172 x 79.5 mm. Coordinates in mm from the lower left corner, seen from the top.
Outline: 3,0 169,0 arc90 172,3 172,76.5 arc90 169,79.5 3,79.5 arc90 0,76.5 0,3 arc90 3,0
Copper layers (1*16): Top 0.035559375mm / dielectric 1.6mm / Bottom 0.035559375mm
Design rules "jlcpcb2layer *": minimum track width 5mil, minimum drill 12mil, track to track 5mil, track to pad 5mil, pad to pad 5mil, via to via 5mil, smd to smd 5mil, copper to edge 8mil, drill to drill 6mil, minimum pad ring 5mil, minimum via ring 3mil, stop-mask expansion 2.5mil, vias tented up to drill 30mil, thermal gap 10mil
Holes 4.5 mm at 63.5,75 5,75 128,75 167.5,75 167,5 128,5 63.5,42.75 5.1,15.15
tRestrict: 6 lines
bRestrict: 3 lines

### Footprints (pad centres in the part's own frame; a part is rotated, then mirrored left to right if it is on the bottom)
CHIPLED_0805 = smd 1.2 x 1.2: A 0,-1.05; C 0,1.05
P1-17 = drill 1.702 pad 2.54 octagon: TP 0,0
16SVF1000M = smd 1.9 x 4.4: 1 0,-4.35; 2 0,4.35
C1206K = smd 1.5 x 2: 1 -1.5,0; 2 1.5,0
C1812 = smd 1.4 x 3.5: 1 -2.05,0; 2 2.05,0
CAPPRD750W80D1825H2700 = drill 1 pad 1.5 square: 1 0,0 | drill 1 pad 1.5: 2 7.5,0
C0805K = smd 1.3 x 1.6: 1 -1,0; 2 1,0
C0603K = smd 1.05 x 1.08: 1 -0.875,0; 2 0.875,0
C0402 = smd 0.7 x 0.9: 1 -0.65,0; 2 0.65,0
C0402K = smd 0.925 x 0.74: 1 -0.6,0; 2 0.6,0
TO-252 = smd 3.048 x 1.524: 1 5.365,-2.286; 2 5.365,2.286 | smd 6.604 x 6.096: 3 -1.493,0
DIOM5127X229N = smd 2.2 x 1.55: 1 -2.05,0; 2 2.05,0
DIOM5336X265N = smd 2.284 x 2.124: 1 -2.164,0; 2 2.164,0
TP13R = smd 1.3 x 1.3: TP 0,0
P1-13 = drill 1.321 pad 2.159 octagon: TP 0,0
SOIC127P600X175-8N = smd 1.5 x 0.65: 1 -2.7,1.905; 2 -2.7,0.635; 3 -2.7,-0.635; 4 -2.7,-1.905; 5 2.7,-1.905; 6 2.7,-0.635; 7 2.7,0.635; 8 2.7,1.905
SOT95P280X145-6N = smd 1.2 x 0.6: 1 -1.25,0.95; 2 -1.25,0; 3 -1.25,-0.95; 4 1.25,-0.95; 5 1.25,0; 6 1.25,0.95
SOT95P280X145-3N = smd 1.2 x 0.6: 1 -1.25,0.95; 2 -1.25,-0.95; 3 1.25,0
TB00576202BE = drill 1.6 pad 2.4 square: 1 0,0 | drill 1.6 pad 2.4: 2 7.62,0
61300211121 = drill 1.1 square: 1 -1.27,0 | drill 1.1: 2 1.27,0
2300LL102VRC = drill 1.06 pad 1.59: 1 0,0; 2 13.208,0
LQH5BPB100MT0L = smd 1.85 x 4.1: 1 -1.825,0; 2 1.825,0
SOP254P1015X230-4N = smd 1.85 x 0.7: 1 -4.7,1.27; 2 -4.7,-1.27; 3 4.7,-1.27; 4 4.7,1.27
D2PAK = smd 1.257 x 3.429: 1 -2.54,-8.192; 3 2.54,-8.192 | smd 10.668 x 9.017: 2 0,1.715
R0805 = smd 1.3 x 1.5: 1 -0.95,0; 2 0.95,0
R0402 = smd 0.6 x 0.7: 1 -0.5,0; 2 0.5,0
R2512 = smd 1.8 x 3.2: 1 -2.8,0; 2 2.8,0
R0603 = smd 1 x 1.1: 1 -0.85,0; 2 0.85,0
R1206 = smd 1.6 x 1.803: 1 -1.422,0; 2 1.422,0
BIGTRANS! = drill 1.905 pad 3.175 octagon: 1 0,0; 2 0,5; 4 0,15; 5 0,20; 6 0,25; 7 0,30; 8 0,35; 9 35,0; 10 35,5; 11 35,10; 12 35,15; 13 35,20; 14 35,25; 15 35,30; 16 35,35 | drill 2.032 pad 3.175 octagon: 3 0,10
B66362B1014T001 = drill 1.75 pad 3.175 octagon: 1 0,0; 2 0,25.4; 3 5.08,0; 4 5.08,25.4; 5 10.16,0; 6 10.16,25.4; 7 15.24,0; 8 15.24,25.4; 9 20.32,0; 10 20.32,25.4; 11 25.4,0; 12 25.4,25.4; 13 30.48,0; 14 30.48,25.4
DPACK = smd 1.6 x 3: 1 -2.28,-4.8; 3 2.28,-4.8 | smd 5.8 x 6.2: 4 0,2.38
DIOM5226X220N = smd 2.3 x 1.55: 1 -2.15,0; 2 2.15,0

### Placement (x,y rotation side)
5VLED  92.5,1.5 90 top
13.75V  41,2 180 top
13.75V_TP  45.5,4 270 top
AUX5V_TP  100.5,2 0 top
AUXBUCK_TP  100.5,14 270 top
C1  22.5,69 0 top
C2  35,69 0 top
C3  45.88,70.88 180 top
C4  158.12,65.62 90 top
C5  163.38,65.62 90 top
C6  146.5,51.5 90 top
C7  146.5,39.5 270 top
C8  15.8,68.1 90 top
C9  15.43,31.5 180 top
C10  19.88,31.12 0 top
C11  15.88,24.5 90 top
C12  22.5,23 180 top
C13  35,23 180 top
C14  35.25,8.88 90 top
C15  46,9 0 top
C16  55,14.5 0 top
C17  73.1,9.6 90 top
C18  76.5,7.88 0 top
C19  81.5,12.12 0 top
C20  85.5,14.12 0 top
C21  90.12,8 0 top
C22  96,10 0 top
C23  96,8.75 0 top
C24  100.5,10 90 top
C25  6,3 90 top
C26  11.93,1 0 top
C27  13,4.5 90 top
C28  22.38,1.88 90 top
C29  24.12,1.88 90 top
C30  25.88,1.88 90 top
C31  43,6.75 90 top
C32  -31.5,-59 0 top  (outside the outline)
C33  72.5,3.12 90 top
C34  87.38,1.75 180 top
C36  49.38,18.5 180 top
D1  -14,-9 0 top  (outside the outline)
D2  -14,-18 0 top  (outside the outline)
D3  -14,-27 0 top  (outside the outline)
D4  -14,-36 0 top  (outside the outline)
D5  10,8.5 180 top
D6  74.5,17 180 top
D7  83,17 180 top
D10  53.12,70.75 0 top
D11  57,22 0 top
GATE1_TP  25.5,58 0 top
GATE2_TP  26.5,44 90 top
GND_TP1  52.5,3.62 0 top
HVLED  164,15 180 top
HVOUT_TP  134.2,7.55 270 top
IC1  16,35 0 top
IC2  46,12.5 180 top
IC3  84.88,11.62 0 top
IC4  10.5,4 270 top
IC5  76.5,4 270 top
INPUT  9.5,50.5 270 top
J1  162.5,41 90 top
J2  80.88,4.88 270 top
L1  120.5,45.5 0 top
L2  -16,-43 0 top  (outside the outline)
L3  -20.5,-48.5 0 top  (outside the outline)
L4  -25,-54 0 top  (outside the outline)
MAINBUCK_TP  22.75,7.88 180 top
OPT1  63.5,16.38 180 top
PWRGND_TP  147.9,7.55 0 top
Q1  34.88,53.12 270 top
Q2  34.88,39.12 270 top
R2  21.5,58.6 0 top
R3  21.5,55.6 0 top
R4  11.62,36.83 270 top
R5  19.56,44.62 0 top
R6  19.56,40 0 top
R7  20.8,33.7 90 top
R8  22.8,33.7 90 top
R9  27.5,8 0 top
R10  30.5,8 0 top
R11  44,17 180 top
R12  49,7.5 90 top
R13  53.5,12.5 0 top
R14  55,16.5 0 top
R15  71.4,11.4 270 top
R16  75.88,11.25 270 top
R17  77.88,11.25 270 top
R18  81.5,10.62 0 top
R19  82.12,13.62 90 top
R20  87.5,10.88 270 top
R21  105,7.1 90 top
R22  106,12 0 top
R23  112.5,12 180 top
R24  118.5,12 180 top
R25  124.5,12 180 top
R26  133,12 180 top
R27  138.5,12 180 top
R28  144,12 180 top
R29  149.5,12 180 top
R30  155,12 180 top
R31  6.5,5.5 180 top
R32  7.1,3.1 270 top
R33  8.18,3.1 270 top
R34  43,1.7 270 top
R35  72.5,6.5 90 top
R36  91.5,4.5 270 top
R37  45.62,75.38 180 top
R38  48,22 180 top
T1  47.5,28.5 0 top
T1.1  52.38,61.12 270 top
U$1  HV  [PSFBC_ELECTRIC_SHOCK]  94.16,72 0 top
U$2  HV  [PSFBC_ELECTRIC_SHOCK]  164.9,59.86 90 top
U$3  155.1,26.85 90 top
U$4  157.43,7.5 0 top
VR1  33.75,3.62 270 top
VR2  98,6 90 top
Z3  86.75,4.5 180 top

### Tracks (layer width: path | path; a pad name or v marks a point on that pad's centre or on a via)
AUX1
  Top 0.813: D6.2 72.45,19.5 69.2,22.75 69.2,57.5 72.83,61.12 T1.1.2
  Top 2.54: 80.15,63.5 T1.16
  Top 3: T1.1.2 80.15,63.5
AUXB  (via drill 0.45)  (4 unrouted)
  Top 0.4: 96.88,8.32 C23.2 96.88,9.78 C22.2 97.53,10.88
  Top 0.55: 93.08,12.43 93.35,12.15
  Top 0.6: C19.1 80.9,10.72 R18.1 | 93.35,12.15 96,12.15 96.65,11.5 C22.2
  Top 0.7: C19.1 80.9,12.9 v81,13 | v90.5,12.5 90.58,12.43
  Bottom 0.35: v81,13 81,12.6 83.73,9.86 88.86,9.86 90.5,11.5 v90.5,12.5
AUXBFILT  (3 unrouted)
AUXD  (3 unrouted)
  Top 0.6: R20.1 87.25,11.62 IC3.5
  Top 1: R16.2 R17.2 79.01,9.83 80.24,8.6 85.94,8.6 88.9,5.64 Z3.1
  pour Top (isolate 0.254, rank 3, no thermals): 88,6 88,1 89.5,1 89.5,10 87.5,12 86,12 86,10 86.5,9.5 86.5,7.5
BRIDGEGND  (via drill 0.4)  (4 unrouted)
  Top 0.3: R11.2 43,17.15 v43,20 | v39,31 28,31 26.5,32.5 26.5,37
  Bottom 0.3: v43,20 43,26 40.5,26 40.5,31 v39,31
  pour Top (isolate 1.016, rank 3, no thermals): 29.1,53.5 21.12,53.5 21.12,35.5 29.1,35.5
BS1
  Top 0.406: IC4.1 11.53,5.38
  Top 0.61: 11.53,5.38 C27.2
BS2
  Top 0.6: IC3.1 83.58,13.07 C20.1
CS-IN
  Top 0.7: R11.1 44.85,16.15 47.87,13.13 IC2.3 50.63,13.13 52,14.5 C16.1
DC+  (6 unrouted)
  Top 0.4: HVOUT_TP.TP 131.58,10.17 R26.2 131.5,12 | 131.5,12 131.5,22 | R25.1 131.5,12
  Top 0.406: 131.5,22 131.5,30
  pour Top (isolate 2.5, rank 2, no thermals): 174,64 130.5,64 130.5,16.5 174,16.5
DRAIN1  (via drill 0.35)  (121 unrouted)
  other vias: 40.6,58.6 40.6,57.8 40.6,57 41.6,58.6 41.6,57.8 41.6,57 42.1,55.7 42.1,54.9 42.1,54.1 42.1,53.3 41.1,55.7 41.1,54.9 41.1,54.1 41.1,53.3 41.6,56.1 41.6,55.3 41.6,54.5 41.6,53.7 40.6,56.1 40.6,55.3 40.6,54.5 40.6,53.7 42.1,59 42.1,58.2 42.1,57.4 42.1,56.6 41.1,59 41.1,58.2 41.1,57.4 41.1,56.6 41.1,52.5 41.6,52.9 40.6,52.9 39.1,58.2 39.1,57.4 39.1,56.6 39.1,55.8 40.1,58.2 40.1,57.4 40.1,56.6 40.1,55.8 39.6,54.5 39.6,53.7 39.6,52.9 40.1,54.9 40.1,54.1 40.1,53.3 40.1,52.5 39.1,54.9 39.1,54.1 39.1,53.3 39.1,52.5 39.6,57.8 39.6,57 39.6,56.2 39.6,55.4 37.5,57.8 37.5,57 37.5,56.2 37.5,55.4 38.5,57.8 38.5,57 38.5,56.2 38.5,55.4 38,54.1 38,53.3 38,52.5 38.5,54.5 38.5,53.7 38.5,52.9 38,58.2 37.5,54.5 37.5,53.7 37.5,52.9 38,57.4 38,56.6 38,55.8 38,55 37,58.2 36.5,57.8 36.5,57 36.5,56.2 36.5,55.4 37,54.1 37,53.3 37,52.5 36.5,54.5 36.5,53.7 36.5,52.9 37,57.4 37,56.6 37,55.8 37,55 53.5,71.5 53.5,70.5 53.5,69.5 54,72 54,71 54,70 54.5,71.5 54.5,70.5 55,71 55,72 54.5,69.5 55.5,71.5 55.5,70.5 56,71 56,72 55,70 56.5,71.5 56.5,70.5 55.5,69.5 56,70 56.5,69.5
  pour Top (isolate 1, rank 2, no thermals): 60.4,72.97 43,72.97 43,61.63 30.5,61.63 30.5,46.84 43.5,46.84 43.5,51.5 48.25,51.5 50.75,49 53.5,49 56,51.5 60.4,51.5
  pour Bottom (isolate 1.016, rank 2, no thermals): 40,80.7 60.45,80.7 60.45,51.5 55.88,51.5 53.38,49 50.88,49 48.38,51.5 36,51.5 36,58.6 40,58.6
DRAIN2  (via drill 0.35)  (120 unrouted)
  Top 1.016: 52.48,35.62 T1.1.11
  other vias: 42.1,39.8 40.6,39.4 40.6,38.6 40.6,37.8 40.6,37 41.6,39.4 41.6,38.6 41.6,37.8 41.6,37 42.1,35.7 42.1,34.9 42.1,34.1 41.1,35.7 41.1,34.9 41.1,34.1 41.6,36.1 41.6,35.3 41.6,34.5 41.6,33.7 40.6,36.1 40.6,35.3 40.6,34.5 40.6,33.7 42.1,39 42.1,38.2 42.1,37.4 42.1,36.6 41.1,39 41.1,38.2 41.1,37.4 41.1,36.6 38.1,39.8 38.1,39 38.1,38.2 38.1,37.4 39.1,39.8 39.1,39 39.1,38.2 39.1,37.4 39.6,36.1 39.6,35.3 39.6,34.5 38.6,36.1 38.6,35.3 38.6,34.5 39.1,36.5 39.1,35.7 39.1,34.9 39.1,34.1 38.1,36.5 38.1,35.7 38.1,34.9 38.1,34.1 39.6,39.4 39.6,38.6 39.6,37.8 39.6,37 38.6,39.4 38.6,38.6 38.6,37.8 38.6,37 40.1,39.8 40.1,39 40.1,38.2 40.1,37.4 40.1,36.5 40.1,35.7 40.1,34.9 40.1,34.1 36.5,39.4 36.5,38.6 36.5,37.8 36.5,37 37.5,39.4 37.5,38.6 37.5,37.8 37.5,37 37,35.7 37,34.9 37,34.1 37.5,36.1 37.5,35.3 37.5,34.5 37,39.8 36.5,36.1 36.5,35.3 36.5,34.5 41.1,39.8 37,39 37,38.2 37,37.4 37,36.6 57.5,23 58,23.5 58,22.5 57.5,22 58,21.5 57.5,21 58.5,21 58.5,22 58.5,23 59,22.5 59,23.5 59,21.5 59.5,22 59.5,23 60,23.5 60,22.5 60,21.5 59.5,21 60.1,40.2 59.1,40.2 60.1,39.2
  pour Bottom (isolate 1.016, rank 3, no thermals): 36,40.1 48.12,40 50.62,42.5 53.38,42.5 55.4,40.48 60.45,40.48 60.45,20.5 56.5,20.5 56.5,24.45 40.5,24.45 40.5,32.8 36,32.8
  pour Top (isolate 1, no thermals): 55.5,40.5 53.5,42.5 50.5,42.5 48,40 43.5,40 43.5,44.5 30.5,44.5 30.5,32 40.38,32 47.88,24.5 55,24.5 56.5,23 56.5,21 57,20.5 60.5,20.5 60.5,40.5
EN1
  Top 0.406: IC4.4 9.45,2.6 R33.2
EN2
  Top 0.6: IC3.4 86.47,10.38 R20.2
FB1
  Top 0.4: R31.1 7.5,5.5 7.5,5.3 7.32,5.3 7.32,5
  Top 0.406: C25.2 R32.1 7.31,3.81 7.32,5 7.33,5.5 | 7.5,5.3 IC4.3
FB2
  Top 0.6: IC3.3 82.05,10.68 R18.2 82,12.03 C19.2 82.12,12.15 R19.1
GNDA  (via drill 0.3, 0.35, 0.4, 0.45)  (151 unrouted)
  Top 0.4: 8.1,8.5 D5.2 | R31.2 5.65,8 6,8 v7,9
  Top 0.406: R34.1 43,3.94 43.5,4.15 43.5,5.25 C31.1 43,3.62 v42.88,3.62 | 55,11 54.88,10.88 | 14.46,34.37 14.5,34.4 | 16.7,1 C26.2 | C15.2 46.88,11.62 44.5,14 | IC2.5 43.4,14.5 44,14.5 44.09,14.5 44.09,14.4 | C15.2 46.88,8.12 v47,8 | C15.2 46.88,8.62 v47.5,8 | C30.1 C29.1 C28.1
  Top 0.6: C26.2 | 22.25,1 C28.1 | v15,32.75 15,31.95 C9.2
  Top 0.61: IC4.2 10.5,6.1 8.1,8.5 | v14.5,33.88 14.5,34.4 v14.5,34.88 | IC1.3 14.46,34.37 | v20.5,1.6 20.5,1 | v21,1.6 21,1
  Top 0.7: 44.09,14.4 44.5,14 | 44,14.5 44.09,14.4 | IC2.5 44.09,14.4 | v17.2,2.2 v16.7,2.2 16.7,1
  Top 0.8: C11.1 16,23.5 16,19.7 v19,19.7 | C10.2 24,31.12 v24,31.5
  Top 0.813: C26.2 20.5,1 21,1 22.25,1 | R9.1 v25.5,8
  Bottom 0.813: v15,32.75 15,33.38 v14.5,33.88 | v7,9 v8,9
  other vias: 8,8 42.48,4.12 42.88,4.62 25.5,9 9.5,33 9,32.5 8.5,33 26,72 24,72 24,73 24,74 24,75 21,75 21,74 21,73 21,72 20,72 20,73 20,74 20,75 19,75 19,74 19,73 19,72 25,72 25,73 25,74 25,75 26,75 26,74 26,73 38.5,72 36.5,72 36.5,73 36.5,74 36.5,75 33.5,75 33.5,74 33.5,73 33.5,72 32.5,72 32.5,73 32.5,74 32.5,75 31.5,75 31.5,74 31.5,73 31.5,72 37.5,72 37.5,73 37.5,74 37.5,75 38.5,75 38.5,74 38.5,73 26,20.7 24,20.7 24,17.7 24,18.7 24,19.7 21,19.7 21,18.7 21,17.7 21,20.7 20,20.7 20,17.7 20,18.7 20,19.7 19,18.7 19,17.7 19,20.7 25,20.7 25,17.7 25,18.7 25,19.7 26,19.7 26,18.7 26,17.7 33.5,16.7 36.5,20.7 36.5,17.7 36.5,18.7 36.5,19.7 33.5,19.7 33.5,18.7 33.5,17.7 33.5,20.7 32.5,20.7 32.5,17.7 32.5,18.7 32.5,19.7 31.5,19.7 31.5,18.7 31.5,17.7 31.5,20.7 37.5,20.7 36.5,15.7 37.5,18.7 37.5,19.7 37.5,16.7 36.5,16.7 37.5,17.7 55.7,13 55.7,12 54,7.2 56,7.2 56.7,13.4 56.5,15.4 56.8,16.4 56.8,17.2 57.2,18.1 56.5,18.1 46.5,11 46,12.5 45.5,12.5 38,10 37,10 38,11 37.5,15.7 8.5,32 10,32.5 9.5,32 9,31.5 10,31.5 8.5,46 55.7,11 49.2,3.5 7.2,8
  pour Bottom (isolate 1.016, rank 6, no thermals): -20,80.05 44.5,80.05 44.5,25.2 60.7,25.2 60.7,-2.5 -20,-2.5
  pour Top (isolate 1.016, rank 6, no thermals): 41.5,79.5 -3.5,79.5 -3.5,68.5 41.5,68.5
  pour Top (isolate 1.016, rank 6, no thermals): 59.87,9.5 59.87,25.5 43.5,25.5 43.5,14.5 53.5,14.5 53.5,17 55,17 55,14 54.5,13.5 54,13.5 53.5,13 53.5,11.5 54,11 54,10 54.5,9.5
  pour Top (isolate 1.016, rank 6, no thermals): 9,17.52 -3.5,23.52 -3.5,2 -1.5,0 4.5,0 6,1.5 6,5.5 7,6.5 8,6.5 9,7.5
  pour Top (isolate 1.016, no thermals): 6.5,5 10.75,5 10.75,6.25 10,7 10,9 9.5,9.5 7,9.5 6.5,9
  pour Top (isolate 1.016, rank 6, no thermals): 59.99,-0.5 59.99,25 54,25 54,17 55,17 55,14 54.5,13.5 54,13.5 47.5,7 47.5,-0.5
  pour Top (no thermals): 43.5,6.5 42.5,6.5 42.5,2.5 43.5,2.5
  pour Top (isolate 1.016, no thermals): 47.5,15 44.5,15 44.5,10 46.5,10 46.5,8.5 47.5,8.5
  pour Top (isolate 1.016, no thermals): 18,46.5 8,46.5 8,31 11.5,31 11.5,38.5 18,38.5
  pour Top (isolate 1.016, no thermals): 39.9,23.9 -3.42,23.9 -3.42,8 10,8 10,10 25,10 25,8 27,8 27,9.3 39.9,9.3
N$1
  Top 0.61: R25.2 R24.1
N$2  (via drill 0.45)
  Top 0.4: IC2.7 39.98,11.87 39.72,12.14 v39.5,12.14 | IC1.2 12.6,35.63 11.9,34.94 v11.9,32.2
  Bottom 0.4: v11.9,32.2 11.9,31.86 13.57,30.18 13.57,22.44 39.5,22.44 v39.5,12.14
N$3  (via drill 0.45)
  Top 0.35: C18.1 74.62,7.88 73.78,8.72 C17.1
  Top 0.4: IC5.2 75.55,6.38 v75.58,6.38 | C18.1 75.62,6.33 | R22.2 106.95,13.05 106.1,13.9 103.9,13.9 103,13 v103,12.5
  Top 0.61: R23.2 R22.2
  Top 0.7: v75.58,6.38 75.62,6.33
  Bottom 0.35: v75.58,6.38 75.58,6.14 J2.1 98.64,6.14 103,10.5 v103,12.5
N$5  (via drill 0.45)
  Top 0.4: v13.15,32.25 13.15,32.95 IC1.4 | IC2.6 40.87,13.13 40.8,13.2 v40.5,13.2
  Bottom 0.4: v40.5,13.2 40.5,23.35 14.5,23.35 14.5,30.9 v13.15,32.25
N$6
  Top 0.254: IC1.8 18.5,37.1 13.5,37.1 IC1.1 12.9,37.3 11.65,37.3
  Top 0.3: R4.1 11.65,37.3
N$7  (via drill 0.45)  (8 unrouted)
  Top 0.813: R2.1 R3.1 20.1,56.05 20.05,56.05 | IC1.7 17.51,35.63 v17.51,36.24 v17.5,36.25
  other vias: 18.9,57.1 18.9,54.4 17.5,35.6 18.9,55.3 18.9,58.9 18.9,56.2 18.9,58
  pour Bottom (isolate 1.016): 18.2,59.25 18.2,38.4 17.1,37.3 17.1,35.38 19.73,35.38 19.7,36.2 19.7,36.9 20.8,38 20.8,59.25
  pour Top (no thermals): 20.75,54 18.5,54 18.5,59.3 20.75,59.3
N$8
  Top 0.61: IC1.5 20.8,33.09 | 20.8,33.09 R7.1 | R8.1 22.8,33.09 20.8,33.09
N$10
  Top 0.813: R9.2 29,8 | 29,8 R10.1 | VR1.1 29,5.91 29,8
N$12
  Top 0.61: R30.1 157.92,12 161.97,16.05 HVLED.A
N$13
  Top 0.406: IC2.2 52.02,11.87 R13.1
N$14
  Top 0.61: R29.1 R30.2
N$15
  Top 0.61: R24.2 R23.1
N$16
  Top 0.4: R21.2 105,11.95 R22.1
N$17
  Top 0.61: R28.1 R29.2
N$18  (via drill 0.45)
  Top 0.35: R15.1 71,12.65 71,14.75 68.2,17.55 OPT1.2 68.2,17.6 v71.7,14.1
  Top 0.4: 77.45,7.8 C18.2
  Top 0.7: IC5.1 77.45,7.8 | v78.5,8 78.38,7.88 C18.2
  Bottom 0.4: v78.5,8 74.5,8 71.7,10.8 v71.7,14.1
N$19
  Top 0.35: OPT1.1 69.2,14.11 69.2,10.3 72.15,7.35 R35.2
N$20
  Top 2: 48.42,71.25 R37.1
  pour Top (isolate 0.2, no thermals): 46.5,69.5 52,69.5 52,78 46.5,78
N$21
  Top 0.5: C17.2 71.47,10.47 R15.2
N$22
  Top 0.406: 13.75V.C 43,0.95 R34.2
N$23
  Top 2: D11.1 R38.1 50.8,18.57 C36.1
  pour Top (isolate 0.2, no thermals): 52.5,24 49.88,24 49.88,17.5 52.5,17.5
N$24
  Top 0.61: R27.1 R28.2
N$26
  Top 0.4: R36.2 91.5,3.27 91.4,3.25 91.4,1.55
  Top 0.8: 5VLED.C 91.4,1.55
N$27
  Top 1: R17.1 R16.1 76.45,12.67 D6.1
N$28
  Top 0.61: R26.1 R27.2
OPTO-EMITT  (via drill 0.45)
  Top 0.7: IC2.1 49,10.6 v49,9.5 R12.2 | OPT1.4 60.66,15.11 61.3,14.47 61.3,10.13 60.66,9.5 v57.5,9.5
  Bottom 0.406: v57.5,9.5 v49,9.5
PRE  (via drill 0.45)  (5 unrouted)
  Top 0.4: R32.2 v7.1,2 | v19,3 19.32,3.33
  Top 0.406: R32.2 6.2,2.6 C25.1
  Top 0.813: VR1.3 28.95,3 29.5,3 29.5,2.88 C30.2
  Bottom 0.4: v7.1,2 7.1,0.5 18,0.5 19,1.5 v19,3
  pour Top (isolate 1.016, rank 3, no thermals): 18.5,2.5 27.5,2.5 27.5,0 30.25,0 30.25,6.87 28.14,6.87 25.25,9.75 18.5,9.75
PWRGND  (via drill 0.35, 0.45)  (64 unrouted)
  Top 0.152: HVLED.C v164,13
  Top 0.4: R21.1 102.65,6.15 v102.5,6
  Top 0.55: 72.62,2.12 C33.1
  Top 0.6: IC3.2 84.62,11.62 v85,12
  Top 0.7: v85,12 v85,13
  Top 0.813: C4.2 C5.2 | C5.2 163.82,67.67 164,67.5 163.55,67.5 C5.2 | C4.2 156.32,67.67 | 156.32,67.67 v156,68 | C4.2 158.45,68 v160.5,68 | v160.5,68 v165.5,68 v165.5,67 | C4.2 164.82,67.67 v165.5,67 | v165.5,67 v156,67 | v156,67 156,67.35 156.32,67.67 | v156,67 v156,68 | v156,68 v160.5,68 | C23.1 95.12,7.17 95.3,7 95.4,7 97.05,5.35
  Top 1.2: C33.1 75.8,2.25 IC5.3 80.22,2.95 J2.2
  Top 1.27: 72.45,2.3 C33.1 | v71.4,2.1 71.42,2.12 72.62,2.12
  Top 2.54: 91.87,62 88.4,62 84.9,58.5 T1.15 80.5,58.5 78.05,56.05 T1.1.4
  Bottom 2.54: 97,62 89,62 85.4,58.4 80.4,58.4 78.05,56.05 T1.1.4 77.53,55.8 73,55.8
  other vias: 81.5,15 80.5,15 81.5,17 80.5,16 84.5,7 85.5,7 80.5,17 81.5,16 83.5,7 93.5,29.12 94.5,29.12 95.5,29.12 95,30.12 94,30.12 94,28.12 95,28.12 90.5,28.12 90.5,29.12 90.5,30.12 98.5,30.12 98.5,29.12 98.5,28.12 95.5,27.12 93.5,27.12 94.5,27.12 91.5,26.62 92.5,26.62 96.5,26.62 97.5,26.62 90.5,26.62 98.5,26.62 102.5,7 160.5,67 92.7,9.9 92.7,9.1 92.7,8.3 82.9,3.2 83.7,3.2 84.6,3.2 70.5,2.1 69.8,2.1 98.5,9
  pour Bottom (isolate 2.5, rank 6, no thermals): 185,81.5 67,81.5 67,-4.5 182,-4.5 186,-0.5 186,80.5
  pour Top (isolate 0.406, rank 5, no thermals): 86,7.5 82,7.5 82,7 81.5,6.5 80,6.5 79.5,6 79.5,1 87,1 87,6.5
  pour Top (no thermals): 95.5,10.5 91,10.5 90.62,10.12 90.62,5.38 91.1,4.9 97,4.9 97,6 95.5,7.5
  pour Top (no thermals): 90.14,26 98.86,26 98.86,31 90.14,31
  pour Bottom (isolate 1.5, no thermals): 106.5,18 67,18 67,1 106.5,1
  pour Top (no thermals): 80,14 82.5,14 82.5,17.5 80,17.5
  pour Top (no thermals): 103,9.5 98.5,9.5 98.5,8.5 100,8.5 100,6.5 102,6.5 102,5.5 105.5,5.5 105.5,6.5 103,6.5
  pour Top (no thermals): 98.86,64.4 90.14,64.4 90.14,59.4 98.86,59.4
Q1G  (2 unrouted)
  Top 0.61: Q1.1 27.5,55.66
  Top 0.813: R3.2 R2.2
  pour Top (no thermals): 28.5,59.5 22,59.5 22,54.5 28.5,54.5
Q2G  (via drill 0.45)  (3 unrouted)
  Top 0.61: v22.05,35.7 22.35,35.4 22.35,35.1 R8.2 R7.2 21.38,35.23 v21.38,35.7
  Top 1.016: Q2.1 26.58,41.77 26.58,43.92 GATE2_TP.TP | GATE2_TP.TP 26.2,43.7 v25.27,43.7 | v25.27,44.4 25.68,44 26.27,44 | GATE2_TP.TP 26.27,44 | 26.27,44 v25.27,43 25.27,41.66 Q2.1 | Q2.1 26,41.66 26,42.7
  Bottom 0.813: 22.05,35.8 21.95,35.7 v20.7,35.7 24.2,39.2 24.2,39.7
  Bottom 1.016: 22.05,35.8 v22.05,35.7 | v22.05,35.7 v21.38,35.7 | v22.05,35.7 22.44,36.09 22.44,37.44 v20.7,35.7 | 25,44.1 25,40.5 24.2,39.7
  other vias: 25.27,42.3 22.75,35.7
  pour Top (no thermals): 23.3,35.85 20.3,35.85 20.3,35 23.3,35
  pour Bottom (isolate 1.016, rank 2, no thermals): 25.4,45 21.4,45 21.4,41 20.43,40.03 20.43,35.45 22.65,35.45 25.4,38.2
  pour Top (no thermals): 24.9,41.1 28.3,41.1 28.3,45 24.9,45
RECT  (via drill 0.45)  (122 unrouted)
  other vias: 110,31 110,29.5 108.5,29.5 108.5,31 105.5,35.5 105.5,32.5 105.5,34 107,32.5 108.5,32.5 108.5,34 108.5,35.5 107,34 107,35.5 110,35.5 110,32.5 110,34 111.5,32.5 111.5,34 111.5,35.5 105.5,29.5 105.5,31 103.5,34 103.5,32.5 103.5,31 104.5,36.5 106,36.5 107.5,36.5 109,36.5 110.5,36.5 112,36.5 113.5,36.5 113,35.5 114.5,35.5 114.5,34 114.5,32.5 114.5,31 114.5,29.5 114.5,28 113,28 111.5,28 110,28 108.5,28 107,28 105.5,28 104,28 113,34 113,31 111.5,31 111.5,29.5 113,29.5 107,29.5 107,31 103.5,29.5 103.5,35.5 113,32.5 108,60 108,61.5 109.5,61.5 109.5,60 112.5,55.5 112.5,58.5 112.5,57 111,58.5 109.5,58.5 109.5,57 109.5,55.5 111,57 111,55.5 108,55.5 108,58.5 108,57 106.5,58.5 106.5,57 106.5,55.5 112.5,61.5 112.5,60 114.5,57 114.5,58.5 114.5,60 113.5,54.5 112,54.5 110.5,54.5 109,54.5 107.5,54.5 106,54.5 104.5,54.5 105,55.5 103.5,55.5 103.5,57 103.5,58.5 103.5,60 103.5,61.5 103.5,63 105,63 106.5,63 108,63 109.5,63 111,63 112.5,63 114,63 105,57 105,60 106.5,60 106.5,61.5 105,61.5 111,61.5 111,60 114.5,61.5 114.5,55.5 105,58.5 122.5,46.5 122.5,44.5 118.5,46.5 118.5,44.5 119.5,47.5 121.5,47.5 121.5,43.5 119.5,43.5
  pour Bottom (isolate 1.27, no thermals): 125,63.25 103.38,63.25 103.38,54.5 115,54.5 118,51.5 118,39.5 114,35.5 114,27.75 125,27.75
  pour Bottom (isolate 1.27, no thermals): 103.38,27.75 114.62,27.75 114.62,36.5 103.38,36.5
  pour Top (isolate 2.5, no thermals): 105.5,36.5 115,36.5 118,39.5 118,51.5 115,54.5 103.5,54.5 103.5,62.5 104.25,63.25 125,63.25 125,27.75 107.75,27.75 105.5,30
REG  (via drill 0.35, 0.45)
  Top 0.254: 11.7,36.25 15.2,36.25 16.2,35.25 16.2,34.2
  Top 0.3: R4.2 11.7,36.25
  Top 0.406: R12.1 48.85,6.5 46.62,6.5 | 46.62,6.5 46.5,6.5 45.5,5.5 13.75V_TP.TP | 43.3,9 43,9 | 44.75,7.75 45,7.5 45.12,7.62 45.12,8 46.62,6.5 | C31.2 41.25,7.75 41,7.5
  Top 0.6: 45.3,4.8 13.75V_TP.TP
  Top 0.8: v17.38,31.5 16.5,31.5 16.2,31.8 16.2,34.2 16.36,34.37 IC1.6 | C10.1 18.38,31.12 v18.38,31.5
  Top 0.813: R10.2 34.5,8 34.5,3.5 37,3.5 37,4 36.13,4 VR1.4 | 17.5,31.1 17.98,31.1 v18.38,31.5 v17.38,31.5 C9.1 | IC2.8 43.17,10.47 | 41.12,10.47 39.88,10.47 v39.88,10.5 v40.5,10.5
  Top 1: IC2.8 43.3,9 C15.1 45.12,8 | 43,9 C31.2 | 43.17,10.47 41.12,10.47 41.12,7.75 | C31.2 44.75,7.75 | VR1.4 36.13,3.05 13.75V.A 41,7.75 41.12,7.75 | C31.2 41.12,7.75 | C14.1 34.5,8
  Bottom 0.813: v39.88,10.5 v40.5,10.5 v41.12,10.5 41.5,10.88 41.5,24.51 16.2,24.4 16.2,29.32 | 16.2,29.32 v18.38,31.5 | 16.2,29.32 16.2,30.32 v17.38,31.5
  pour Top (isolate 0.5, rank 5, no thermals): 46,11 39.5,11 39.5,9 31,9 31,7 31.5,7 31.5,-1.5 47.5,-1.5 47.5,5.5 49.5,5.5 49.5,7.5 46,7.5
REG5V  (via drill 0.45)  (1 unrouted)
  Top 0.4: R35.1 72.5,4.8 C33.2
  Top 0.55: AUX5V_TP.TP 100.38,2
  Top 0.6: 5VLED.A 93.62,1.57 v93.62,2.75 97.75,2.75 98.95,3.95 VR2.2 99.28,5.12 | 71,5.65 70.85,5.65 67.19,9.31
  Top 0.61: v74,5 73.35,5.65 R35.1 71,5.65
  Top 1.27: 72.5,4.8 73.8,4.8 73,4 C33.2 70.85,5.65
  Bottom 0.55: v93.62,2.75 91.88,1 73.5,1 73.5,4.5 v74,5
RT
  Top 0.406: IC2.4 50.41,14.4 52,16 53.65,16 R14.1
SWITCH1  (2 unrouted)
  Top 0.406: C27.1 14.38,3.62 14.5,3.5
  Top 0.61: IC4.6 11.75,3 12.38,3 C27.1
  pour Top (isolate 0.5, rank 3, no thermals): 17,2.25 17,9.5 10.88,9.5 10.88,6.5 13.5,6.5 14,6 14,4.5 12.75,3.25 11.25,3.25 11.25,2.25
SWITCH2  (3 unrouted)
  pour Top (isolate 0.305, rank 2, no thermals): 86,12.5 86.5,12.5 87,13 88.5,13 89.5,14 94,14 94,17.5 86,17.5
TRANS1  (via drill 0.45)  (72 unrouted)
  Bottom 0.4: 79.3,46 84.1,46 | 85,46 85.5,46
  Bottom 0.8: 85.05,40.05 85.15,40.15
  Bottom 1: 89.25,47.5 v89.5,47.5
  Bottom 1.2: v89.5,47.5 92.7,47.5 93.5,48.3 | 89.25,47.5 89.25,46
  Bottom 1.27: 89.25,46 87.5,46 85.5,46 | T1.1.8 77.89,46 79.3,46 | 84.1,46 85,46
  Bottom 2.54: T1.11 83.5,38.5 85.05,40.05 | 85.15,40.15 86,41 86,42.3
  other vias: 95.5,50.5 95.5,49 94,49 94,50.5 91,55 91,52 91,53.5 92.5,52 94,52 94,53.5 94,55 92.5,53.5 92.5,55 95.5,55 95.5,52 95.5,53.5 97,52 97,53.5 97,55 91,49 91,50.5 89,53.5 90,56 91.5,56 93,56 94.5,56 96,56 97.5,56 99,56 98.5,55 100,55 100,53.5 100,52 100,50.5 100,49 100,47.5 98.5,47.5 97,47.5 95.5,47.5 94,47.5 92.5,47.5 91,47.5 98.5,53.5 98.5,50.5 97,50.5 97,49 98.5,49 92.5,49 92.5,50.5 89,55 98.5,52 106.5,49.5 106.5,48.5 106.5,47.5 111.5,47.5 111.5,48.5 111.5,49.5 113.5,49.5 113.5,48.5 113.5,47.5 110,49.5 103.5,47.5 108,49.5 108,47.5 109,47.5 110,47.5 109,49.5 104.5,47.5
  pour Top (isolate 2.5, no thermals): 114,50 102.88,50 100.5,52.38 100.5,56.5 89,56.5 88.5,56 88.5,47 114,47
  pour Bottom (isolate 2.5, no thermals): 100.5,56.5 89,56.5 88.5,56 88.5,47.12 113.88,47.12 113.88,49.88 102.89,49.88 100.5,52.27
TRANS2  (via drill 0.45)  (69 unrouted)
  Top 2.54: T1.1.14 80.52,27.9 83,27.9 89,33.9 v89,36
  Top 3: T1.1.14 79.92,28.5 T1.9
  other vias: 93.5,40.5 93.5,42 95,42 95,40.5 98,36 98,39 98,37.5 96.5,39 95,39 95,37.5 95,36 96.5,37.5 96.5,36 93.5,36 93.5,39 93.5,37.5 92,39 92,37.5 92,36 98,42 98,40.5 100,37.5 100,39 100,40.5 99,35 97.5,35 96,35 94.5,35 93,35 91.5,35 90,35 90.5,36 89,37.5 92,43.5 93.5,43.5 95,43.5 96.5,43.5 98,43.5 99.5,43.5 90.5,37.5 90.5,40.5 92,40.5 92,42 90.5,42 96.5,42 96.5,40.5 100,42 100,36 90.5,39 106.5,43.5 106.5,42.5 106.5,41.5 111.5,43.5 111.5,42.5 111.5,41.5 108,43.5 109,43.5 110,43.5 110,41 109,41 108,41 113.5,41.5 113.5,42.5 113.5,43.5 104.5,43.5 103.5,43.5
  pour Top (isolate 2.5, no thermals): 114,44 87,44 87,35 82.5,30.5 79.5,30.5 77.5,32.5 76.5,32.5 75.5,31.5 75.5,29.5 78,27 83,27 90,34 100.5,34 100.5,37.5 103.5,40.5 114,40.5
  pour Bottom (isolate 2.5, no thermals): 114,44 88.6,44 88.6,34 100.5,34 100.5,37.49 103.51,40.5 114,40.5
VCCIN  (via drill 0.35, 0.45)  (113 unrouted)
  Top 0.305: 22.4,27.55 22.8,27.15
  Top 0.406: R33.1 8.18,3.8 10.25,3.8 10.5,3.55 IC4.5 | C26.1 10.8,1 10.5,1.3 10.5,1.1
  Top 0.61: IC4.5 10.5,1.3 | 10.5,1.1 3.2,1.1 1.4,2.9 1.4,25.7
  Top 0.8: C11.2 15.88,27 v19.5,27
  Top 1.2: 43,75 44,75
  Top 1.5: C3.2 44.38,68.88 42,66.5 39,66.5 v37.5,65
  Top 2: C36.2 45.2,21.18 R38.2
  Top 3: R38.2 39.7,27.5 v37.5,27.5
  other vias: 45,46 54,47.5 54,44 45,50 45,42 26,63 24,63 24,64 24,65 24,66 21,66 21,65 21,64 21,63 20,63 20,64 20,65 20,66 19,66 19,65 19,64 19,63 25,63 25,64 25,65 25,66 26,66 26,65 26,64 38.5,63 36.5,63 36.5,64 36.5,65 36.5,66 33.5,66 33.5,65 33.5,64 33.5,63 32.5,63 32.5,64 32.5,65 32.5,66 31.5,66 31.5,65 31.5,64 31.5,63 37.5,63 37.5,64 37.5,66 38.5,66 38.5,65 38.5,64 25.5,28 24.5,28 24,26.5 24,27.5 24,28.5 21,28.5 21,27.5 21,26.5 20.5,28 20,26.5 20,27.5 20,28.5 19,28.5 19,27.5 19,26.5 19.5,28 25.5,27 25,26.5 25,27.5 25,28.5 26,28.5 26,27.5 26,26.5 38,27 37,28 36.5,26.5 36.5,27.5 36.5,28.5 33.5,28.5 33.5,27.5 33.5,26.5 33,28 32,27 32.5,26.5 32.5,27.5 32.5,28.5 31.5,28.5 31.5,27.5 31.5,26.5 32,28 38,28 37.5,26.5 37.5,28.5 38.5,28.5 38.5,27.5 38.5,26.5
  pour Top (isolate 1.016, no thermals): 18.05,65 4.5,65 4.5,47.25 18.05,47.25
  pour Top (isolate 1.016, rank 3, no thermals): 41.5,62.5 7,62.5 7,29.5 22,29.5 22,25.38 -4,25.38 -4,67.5 41.5,67.5
  pour Top (isolate 1.016, rank 6, no thermals): 55,42.13 55,48.87 53.37,50.5 44.5,50.5 44.5,41 53.87,41
  pour Bottom (isolate 1.016, rank 5, no thermals): 55,51 39.1,51 39.1,67.5 26.6,67.5 26.6,30 18.25,30 18.25,25.2 39.1,25.2 39.1,40.9 55,40.9
  pour Top (isolate 0.6, no thermals): 40,30 1.07,30 1.07,25.1 40,25.1
  pour Bottom (isolate 1.016, rank 2, no thermals): 35,67.5 18,67.5 18,60 35,60
  pour Top (isolate 1.5, no thermals): 45.5,78.5 42,78.5 42,67.5 37,67.5 37,64.5 42.5,64.5 45.5,67.5
  pour Top (isolate 0.2, rank 5, no thermals): 48.75,22 41,29.75 37.12,29.75 37.12,25.12 40,25.12 47.62,17.5 48.75,17.5

### Text on the board
tNames: ABS MAX 35V IN | +VBATT | HV OUT | GND | GND_HV | *** WARNING / HV PRESENT ***